# Altium project WR_NIC.PrjPcb (part 1 of 2)
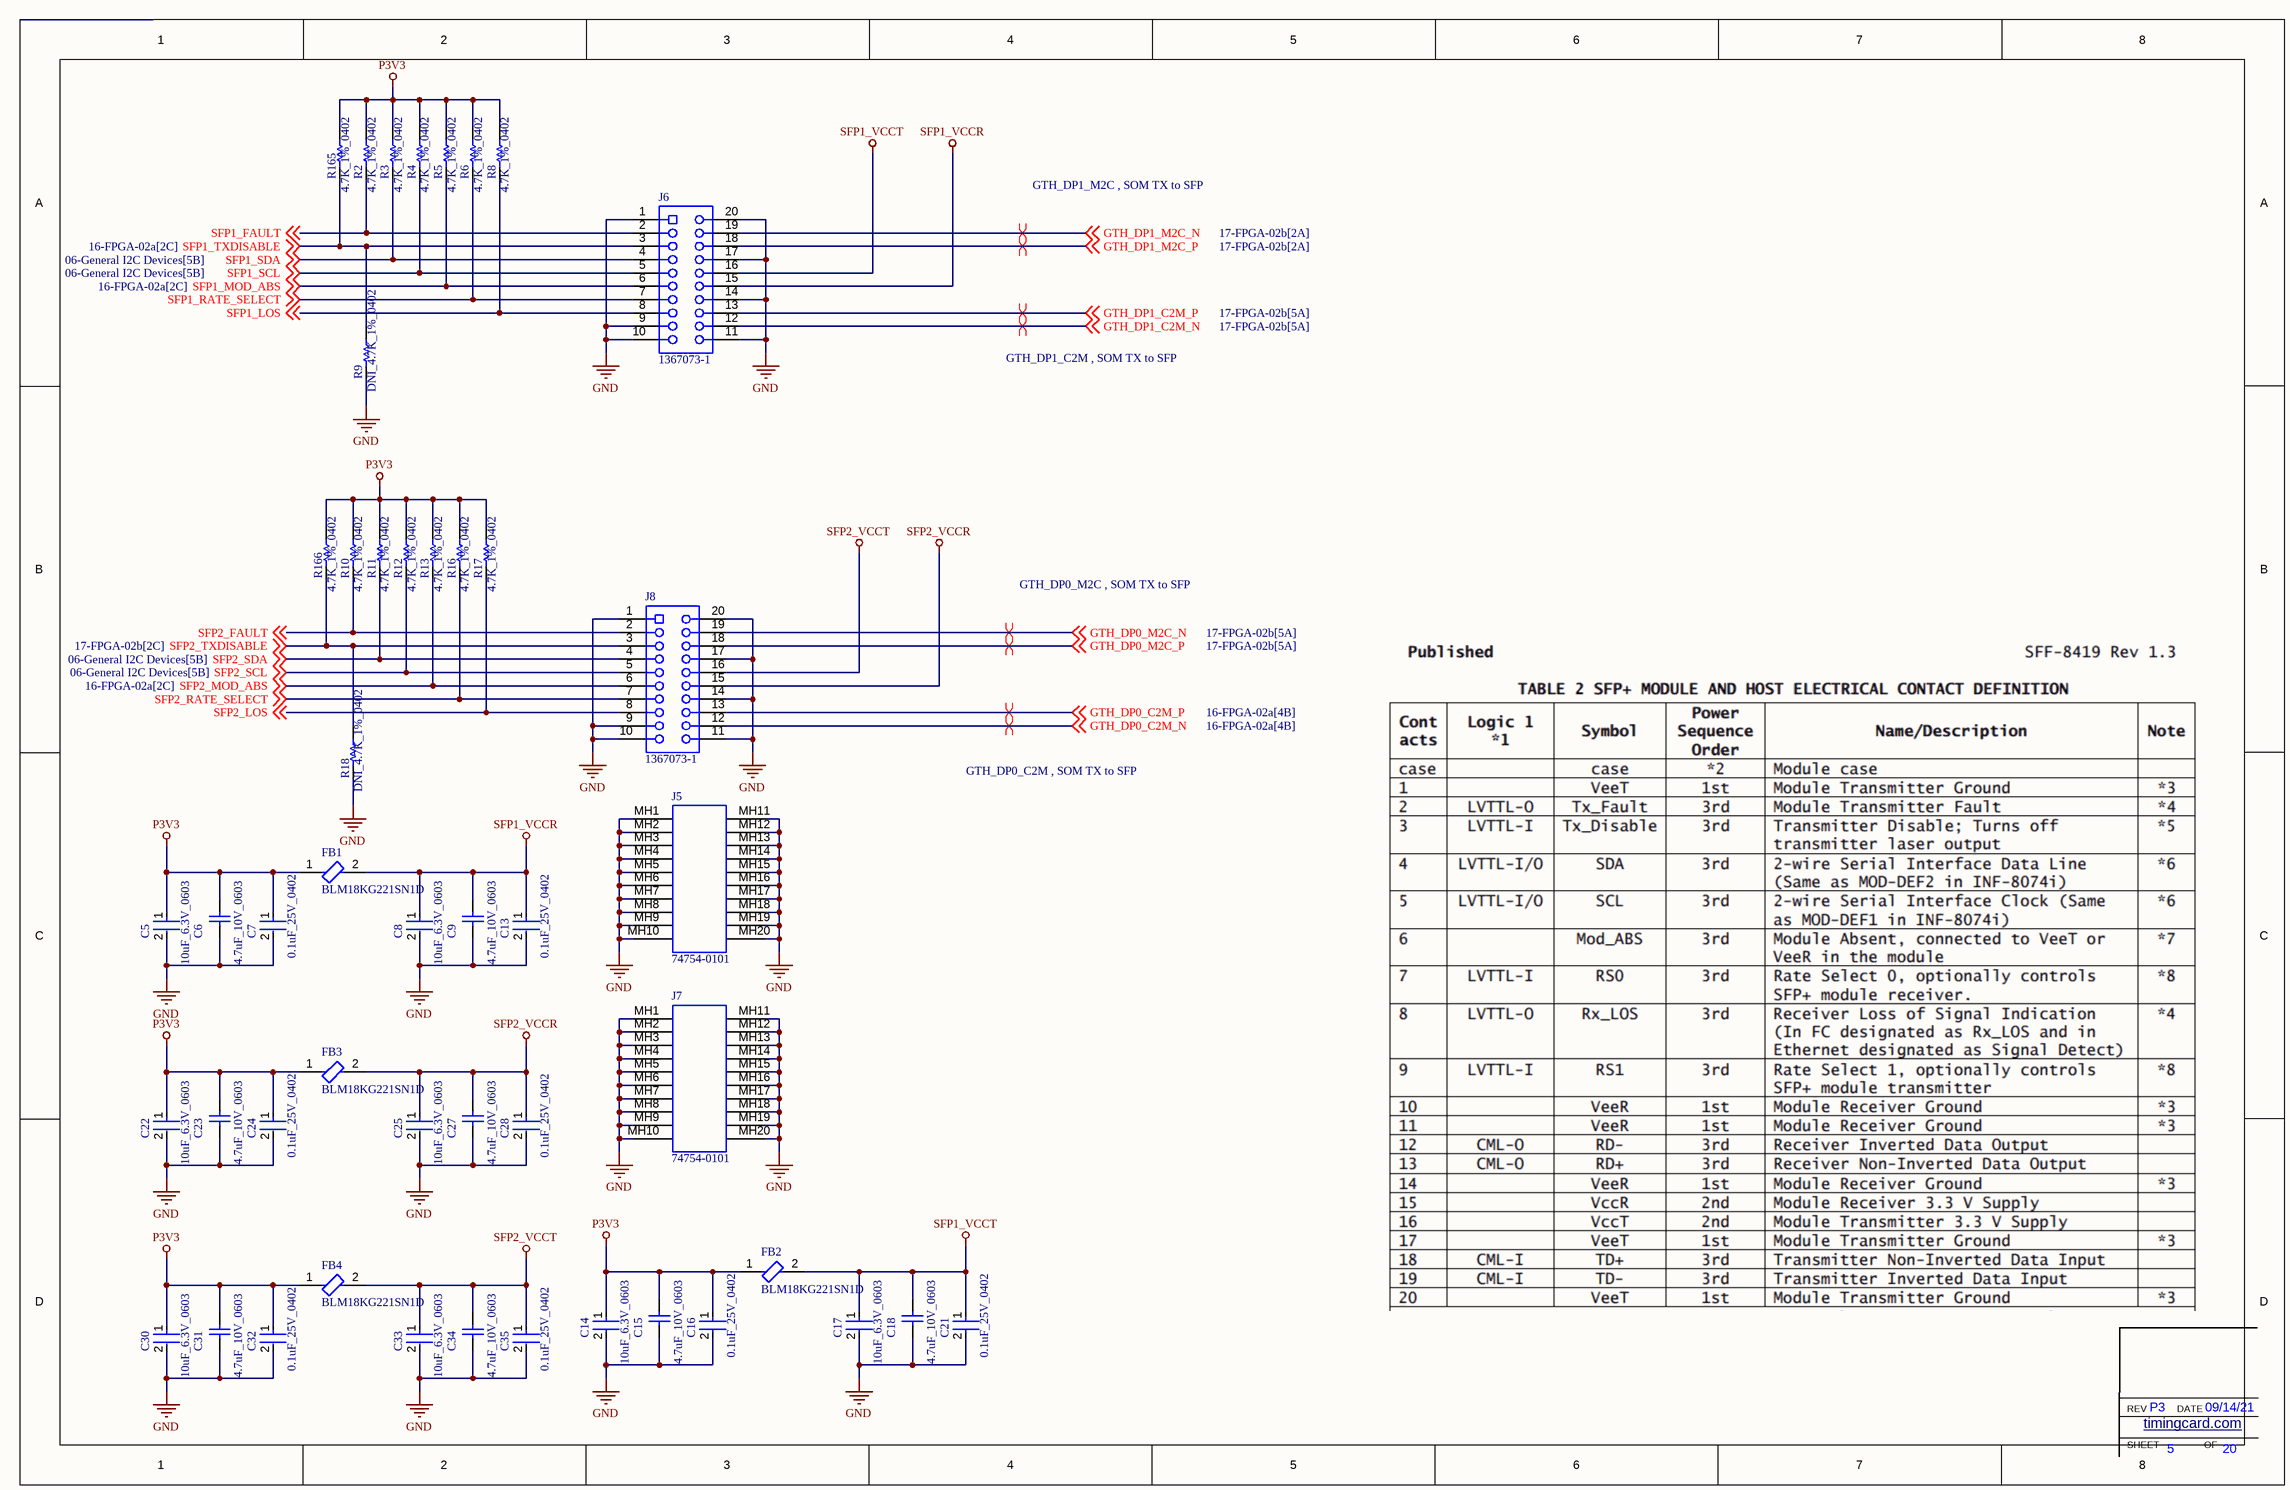
[diagram p0: 05-Front Panel SFP+.SchDoc]
ProjectDate: 09/14/21; ProjectRevision: P3
7 sheets, 308 parts. Net scope: global (net labels, ports and power ports of the same name join across sheets).
Board file: WR_NIC_V1.PcbDoc
Sheets:
  05-Front Panel SFP+.SchDoc
  06-General I2C Devices.SchDoc
  08-DPLL-2.SchDoc
  09-DPLL-3.SchDoc
  13-Experimental.SchDoc
  14-FPGA-01a.SchDoc
  16-FPGA-02a.SchDoc

## Sheet 05-Front Panel SFP+.SchDoc
size Tabloid; Customer: 01910; SheetNumber: 5; SheetTotal: 20

### Parts
C5  10uF_6.3V_0603  [FP-C0603C106M9PACTU-MFG]
C6  4.7uF_10V_0603  [CAPC1608X87X35NL15T15]
C7  0.1uF_25V_0402  [FP-0402-L_1_0_1-W_0_5_0_1-IPC_C]
C8  10uF_6.3V_0603  [FP-C0603C106M9PACTU-MFG]
C9  4.7uF_10V_0603  [CAPC1608X87X35NL15T15]
C13  0.1uF_25V_0402  [FP-0402-L_1_0_1-W_0_5_0_1-IPC_C]
C14  10uF_6.3V_0603  [FP-C0603C106M9PACTU-MFG]
C15  4.7uF_10V_0603  [CAPC1608X87X35NL15T15]
C16  0.1uF_25V_0402  [FP-0402-L_1_0_1-W_0_5_0_1-IPC_C]
C17  10uF_6.3V_0603  [FP-C0603C106M9PACTU-MFG]
C18  4.7uF_10V_0603  [CAPC1608X87X35NL15T15]
C21  0.1uF_25V_0402  [FP-0402-L_1_0_1-W_0_5_0_1-IPC_C]
C22  10uF_6.3V_0603  [FP-C0603C106M9PACTU-MFG]
C23  4.7uF_10V_0603  [CAPC1608X87X35NL15T15]
C24  0.1uF_25V_0402  [FP-0402-L_1_0_1-W_0_5_0_1-IPC_C]
C25  10uF_6.3V_0603  [FP-C0603C106M9PACTU-MFG]
C27  4.7uF_10V_0603  [CAPC1608X87X35NL15T15]
C28  0.1uF_25V_0402  [FP-0402-L_1_0_1-W_0_5_0_1-IPC_C]
C30  10uF_6.3V_0603  [FP-C0603C106M9PACTU-MFG]
C31  4.7uF_10V_0603  [CAPC1608X87X35NL15T15]
C32  0.1uF_25V_0402  [FP-0402-L_1_0_1-W_0_5_0_1-IPC_C]
C33  10uF_6.3V_0603  [FP-C0603C106M9PACTU-MFG]
C34  4.7uF_10V_0603  [CAPC1608X87X35NL15T15]
C35  0.1uF_25V_0402  [FP-0402-L_1_0_1-W_0_5_0_1-IPC_C]
FB1  BLM18KG221SN1D  [FP-BLM18-0_15-t0_8-IPC_B]
FB2  BLM18KG221SN1D  [FP-BLM18-0_15-t0_8-IPC_B]
FB3  BLM18KG221SN1D  [FP-BLM18-0_15-t0_8-IPC_B]
FB4  BLM18KG221SN1D  [FP-BLM18-0_15-t0_8-IPC_B]
J5  74754-0101  [MOLX-74754-0101_V]
J6  1367073-1  [TECO-1367073-1_V]
J7  74754-0101  [MOLX-74754-0101_V]
J8  1367073-1  [TECO-1367073-1_V]
R2  4.7K_1%_0402  [RESC1005X40X25NL10T10]
R3  4.7K_1%_0402  [RESC1005X40X25NL10T10]
R4  4.7K_1%_0402  [RESC1005X40X25NL10T10]
R5  4.7K_1%_0402  [RESC1005X40X25NL10T10]
R6  4.7K_1%_0402  [RESC1005X40X25NL10T10]
R8  4.7K_1%_0402  [RESC1005X40X25NL10T10]
R9  DNI_4.7K_1%_0402  [RESC1005X40X25NL10T10]  (no BOM)
R10  4.7K_1%_0402  [RESC1005X40X25NL10T10]
R11  4.7K_1%_0402  [RESC1005X40X25NL10T10]
R12  4.7K_1%_0402  [RESC1005X40X25NL10T10]
R13  4.7K_1%_0402  [RESC1005X40X25NL10T10]
R16  4.7K_1%_0402  [RESC1005X40X25NL10T10]
R17  4.7K_1%_0402  [RESC1005X40X25NL10T10]
R18  DNI_4.7K_1%_0402  [RESC1005X40X25NL10T10]  (no BOM)
R165  4.7K_1%_0402  [RESC1005X40X25NL10T10]
R166  4.7K_1%_0402  [RESC1005X40X25NL10T10]

### Nets
GND: C5.2 C6.1 C7.2 C8.2 C9.1 C13.2 C14.2 C15.1 C16.2 C17.2 C18.1 C21.2 C22.2 C23.1 C24.2 C25.2 C27.1 C28.2 C30.2 C31.1 C32.2 C33.2 C34.1 C35.2 J5.MH1 J5.MH2 J5.MH3 J5.MH4 J5.MH5 J5.MH6 J5.MH7 J5.MH8 J5.MH9 J5.MH10 J5.MH11 J5.MH12 J5.MH13 J5.MH14 J5.MH15 J5.MH16 J5.MH17 J5.MH18 J5.MH19 J5.MH20 J6.1 J6.9 J6.10 J6.11 J6.14 J6.17 J6.20 J7.MH1 J7.MH2 J7.MH3 J7.MH4 J7.MH5 J7.MH6 J7.MH7 J7.MH8 J7.MH9 J7.MH10 J7.MH11 J7.MH12 J7.MH13 J7.MH14 J7.MH15 J7.MH16 J7.MH17 J7.MH18 J7.MH19 J7.MH20 J8.1 J8.9 J8.10 J8.11 J8.14 J8.17 J8.20 R9.2 R18.2
P3V3: C5.1 C6.2 C7.1 C14.1 C15.2 C16.1 C22.1 C23.2 C24.1 C30.1 C31.2 C32.1 FB1.1 FB2.1 FB3.1 FB4.1 R2.1 R3.1 R4.1 R5.1 R6.1 R8.1 R10.1 R11.1 R12.1 R13.1 R16.1 R17.1 R165.1 R166.1
SFP1_VCCR: C8.1 C9.2 C13.1 FB1.2 J6.15
SFP1_VCCT: C17.1 C18.2 C21.1 FB2.2 J6.16
SFP2_VCCR: C25.1 C27.2 C28.1 FB3.2 J8.15
SFP2_VCCT: C33.1 C34.2 C35.1 FB4.2 J8.16
GTH_DP0_C2M_N: J8.12 ; off-sheet GTH_DP0_C2M_N
GTH_DP0_C2M_P: J8.13 ; off-sheet GTH_DP0_C2M_P
GTH_DP0_M2C_N: J8.19 ; off-sheet GTH_DP0_M2C_N
GTH_DP0_M2C_P: J8.18 ; off-sheet GTH_DP0_M2C_P
GTH_DP1_C2M_N: J6.12 ; off-sheet GTH_DP1_C2M_N
GTH_DP1_C2M_P: J6.13 ; off-sheet GTH_DP1_C2M_P
GTH_DP1_M2C_N: J6.19 ; off-sheet GTH_DP1_M2C_N
GTH_DP1_M2C_P: J6.18 ; off-sheet GTH_DP1_M2C_P
SFP1_FAULT: J6.2 R2.2 ; off-sheet SFP1_FAULT
SFP1_LOS: J6.8 R8.2 ; off-sheet SFP1_LOS
SFP1_MOD_ABS: J6.6 R5.2 ; off-sheet SFP1_MOD_ABS
SFP1_RATE_SELECT: J6.7 R6.2 ; off-sheet SFP1_RATE_SELECT
SFP1_SCL: J6.5 R4.2 ; off-sheet SFP1_SCL
SFP1_SDA: J6.4 R3.2 ; off-sheet SFP1_SDA
SFP1_TXDISABLE: J6.3 R9.1 R165.2 ; off-sheet SFP1_TXDISABLE
SFP2_FAULT: J8.2 R10.2 ; off-sheet SFP2_FAULT
SFP2_LOS: J8.8 R17.2 ; off-sheet SFP2_LOS
SFP2_MOD_ABS: J8.6 R13.2 ; off-sheet SFP2_MOD_ABS
SFP2_RATE_SELECT: J8.7 R16.2 ; off-sheet SFP2_RATE_SELECT
SFP2_SCL: J8.5 R12.2 ; off-sheet SFP2_SCL
SFP2_SDA: J8.4 R11.2 ; off-sheet SFP2_SDA
SFP2_TXDISABLE: J8.3 R18.1 R166.2 ; off-sheet SFP2_TXDISABLE

### Layout directives
differential pair: GTH_DP0_C2M_N, GTH_DP0_C2M_P, GTH_DP0_M2C_N, GTH_DP0_M2C_P, GTH_DP1_C2M_N, GTH_DP1_C2M_P, GTH_DP1_M2C_N, GTH_DP1_M2C_P

### Notes on the sheet
- GTH_DP1_M2C , SOM TX to SFP
- GTH_DP1_C2M , SOM TX to SFP
- GTH_DP0_M2C , SOM TX to SFP
- GTH_DP0_C2M , SOM TX to SFP
- SHEET
- REV
- timingcard.com <http://timingcard.com>
- DATE
- OF

### Library data of the parts
C5 C8 C14 C17 C22 C25 C30 C33 = CMP-2006-02285-3: CAP CER 10UF 6.3V X5R 0603; Manufacturer Part Number: C0603C106M9PACTU; Manufacturer: Kemet; Material: Ceramic; Temperature Coefficient: 15%; Tolerance: 20%; Category: Cap; Height: 0.9mm; Digikey Description: CAP CER 10UF 6.3V X5R 0603; Mouser Description: In a Pack of 10, KEMET 0603 (1608M) 10µF MLCC 6.3V dc ±20% SMD C0603C106M9PACTU; Voltage Rating: 6.3V; Device Class L2: Capacitors; Temperature Range Low: -55°C; Temperature Characteristic: X5R; ComponentLink2Description: Datasheet; Ipc Land Pattern Name: CAPC16080X80; ComponentLink2URL: http://www.kemet.com/Lists/ProductCatalog/Attachments/19/KEM_C1006_X5R_SMD.pdf; Capacitance: 10uF; Temperature Range High: +85°C; Device Class L3: Ceramic Capacitors; RoHS: TRUE; Automotive: No; Value: 10uF; Temperature: -55°C to +85°C; Device Class L1: Passive Components; Package: C0603C106M9PACTU; Lead Free: Yes; Octopart: https://octopart.com/c0603c106m9pactu-kemet-8375727
C6 C9 C15 C18 C23 C27 C31 C34 = CMP-2006-03238-1: Part Number: C0603C475K8PACTU; Manufacturer: Kemet
C7 C13 C16 C21 C24 C28 C32 C35 = CMP-2008-02519-2: General Purpose Ceramic Capacitor, 0402, 100nF, 10%, X7R, 15%, 25V; Package Quantity: 1; Capacitance: 100nF; Min Operating Temperature: -55°C; Voltage: 25V; Voltage Rating: 25V; Construction: Flat; Max Operating Temperature: 125°C; Radiation Hardening: No; Depth: 0.5mm; Thickness: 0.022inch; Voltage Rating (DC): 25V; Number of Pins: 2; Lead Free: Lead Free; Series: -; REACH SVHC: No SVHC; Length: 1mm; Dielectric: X7R; RoHS Compliant: Yes; Mount: Surface Mount; Packaging: Tape and Reel; Case/Package: 0402; Case Code (Imperial): 0402; Termination: SMD/SMT; Width: 0.02inch; Case Code (Metric): 1005; Tolerance: 10%
FB1-FB4 = CMP-0686-00556-7: Chip Ferrite Bead, 0603, 220Ω @ 100MHz, 0.05Ω, 25%, 2.2A; DC Resistance (DCR): 50mR; Number of Circuits: 1; Impedance: 220R; Current Rating: 2.2A; Material: Ferrite; Test Frequency: 100MHz; Depth: 0.8mm; Series: BLM18K; RoHS Compliant: Yes; Termination: SMD/SMT; Max Current Rating: 2.2A; Case Code (Metric): 1608; Radiation Hardening: No; Number of Pins: 2; Length: 1.6mm; Lead Free: Lead Free; Package Quantity: 1; Height: 0.8mm; Core Material: Ferrite; Inductor Type: FERRITE BEAD; Min Operating Temperature: -55°C; Case/Package: 0603; Case Code (Imperial): 0603; Number of Lines: 1; Packaging: Tape and Reel; REACH SVHC: No SVHC; Max Operating Temperature: 125°C; Military Standard: Not; DC Resistance-Max: 50mR; Width: 0.8mm; DC Current: 2.2A; Max DC Current: 2.2A; Tolerance: 25%; Weight: 7.1E-05oz
J5 J7 = CMP-1704-00003-3: SFP+ Cage, Single Port, Height 10.85 mm, Tail Height 3.05 mm, -40 to 85 degC, RoHS, Tray; RoHSCompliant: True; ComponentLink3URL: http://www.molex.com/pdm_docs/sd/747540101_sd.pdf; Width: 49 mm; Height: 10.85 mm; Mounting Technology: Through Hole; ComponentLink2Description: Datasheet; ComponentLink3Description: Package Specification; DatasheetVersion: Rev. Jul-15; Package Quantity: 1152; PackageDescription: SFP+ Cage, Single Port, Height 10.85 mm, Tail Height 3.05 mm; Radiation Hardening: No; PackageVersion: Rev. J, 02/2015; ComponentLink1Description: Manufacturer URL; PartNumber: 74754-0101; ComponentLink1URL: http://www.molex.com/; Packaging: Tray; Length: 15.9 mm; ComponentLink2URL: http://www.molex.com/webdocs/datasheets/pdf/en-us/0747540101_IO_CONNECTORS.pdf
J6 J8 = CMP-2000-05488-1: Female Connector, Pitch 0.8 mm, 2 x 10 Position, Height 5.4 mm, -55 to 85 degC, RoHS, Tape and Reel; Manufacturer: TE Connectivity; Product Training Modules: HighSpeedPluggableI/OSolutions; 3D Model: 1367073-1.pdf; Connector Type: SFP; Other Names: A97430DKR; Mating Products: 516-2084-ND / -TXRXOPTICALSFF1.25GBDISCSI; Dynamic Catalog: SFPConnectors; Featured Product: HighSpeedPluggableI-OSolutions; Connector Style: Receptacle; Associated Product: A103997CT-ND / -CONNSFPCAGESINGLEW/OPIPE / A103997TR-ND / -CONNSFPCAGESINGLEW/OPIPE / 1367645-3-ND / -CONNCAGE&HEATSINKSGLPORTTIN / 1367645-2-ND / -CONNCAGE&HEATSINKSGLPORTTIN / 1888424-1-ND / -CONNCAGE1X2SFPENHANCEDEMI / 1367643-1-ND / -CONNCAGESNGLPORTDBLSIDETIN / 1489962-1-ND / -CONNSFPCAGESINGLEW/OPIPE / 1367645-1-ND / -CONNCAGE&HEATSINKSGLPORTTIN / A99375-ND / -CONNSFPCAGE1X4PIN-IN-PASTE / A97412CT-ND / -CONNSFPLOWERCAGEPCB / More...; Number of Positions: 20; Package Reference: 1367073-1; Package Description: Female Connector, Pitch 0.8 mm, 2 x 10 Position, Height 5.4 mm; RoHS Information: 1367073-1StatementofCompliance; Contact Finish: Gold; Datasheet URL: http://www.te.com/commerce/DocumentDelivery/DDEController?Action=showdoc&DocId=Customer+Drawing%7F1367073%7FK%7Fpdf%7FEnglish%7FENG_CD_1367073_K.pdf%7F1367073-1; Datasheet Version: Rev. K, 12/2012; Contact Finish Thickness: 15µin(0.38µm); Category: Connectors,Interconnects; Mounting Type: SurfaceMount,RightAngle; Mounting Technology: SurfaceMount; Packaging: Digi-Reel®; Manufacturer URL: http://www.te.com/; Family: PluggableConnectors; Standard Package: 1; Termination: Solder
R2-R6 R8-R13 R16-R18 R165 R166 = CMP-2002-05217-1: Manufacturer: Bourns; Part Number: CR0402-FX-4701GLF

## Sheet 06-General I2C Devices.SchDoc
size B; SheetNumber: 6; SheetTotal: 20
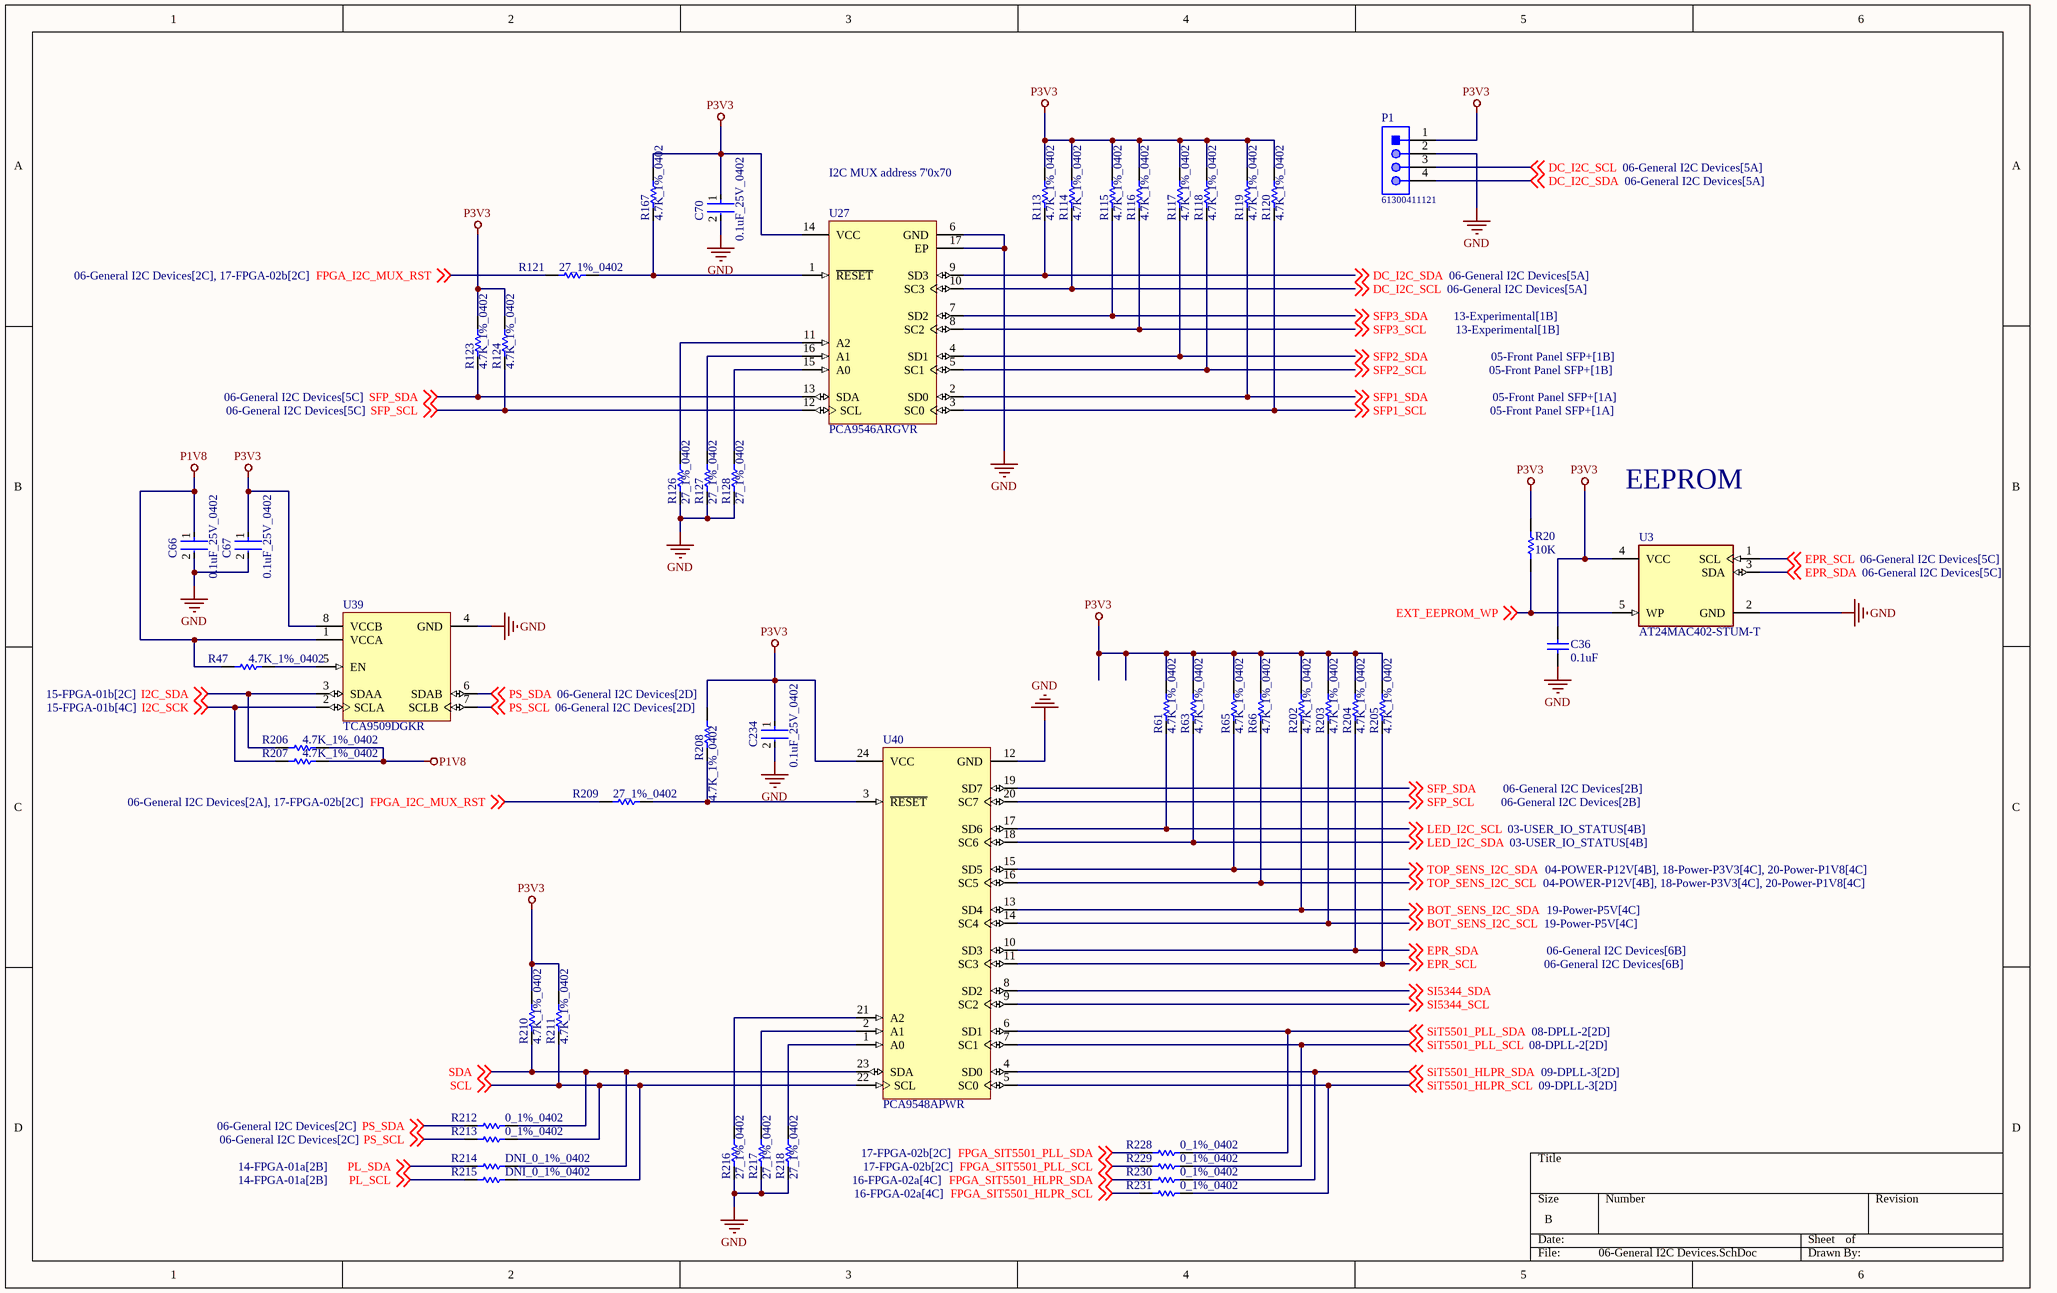
[diagram p1: 06-General I2C Devices.SchDoc]

### Parts
C36  0.1uF  [CAPC1608X87X45ML20T05]
C66  0.1uF_25V_0402  [FP-0402-L_1_0_1-W_0_5_0_1-IPC_C]
C67  0.1uF_25V_0402  [FP-0402-L_1_0_1-W_0_5_0_1-IPC_C]
C70  0.1uF_25V_0402  [FP-0402-L_1_0_1-W_0_5_0_1-IPC_C]
C234  0.1uF_25V_0402  [FP-0402-L_1_0_1-W_0_5_0_1-IPC_C]
P1  61300411121  [61300411121]
R20  10K  [RESC1608X55X30LL15T20]
R47  4.7K_1%_0402  [RESC1005X40X25NL10T10]
R61  4.7K_1%_0402  [RESC1005X40X25NL10T10]
R63  4.7K_1%_0402  [RESC1005X40X25NL10T10]
R65  4.7K_1%_0402  [RESC1005X40X25NL10T10]
R66  4.7K_1%_0402  [RESC1005X40X25NL10T10]
R113  4.7K_1%_0402  [RESC1005X40X25NL10T10]
R114  4.7K_1%_0402  [RESC1005X40X25NL10T10]
R115  4.7K_1%_0402  [RESC1005X40X25NL10T10]
R116  4.7K_1%_0402  [RESC1005X40X25NL10T10]
R117  4.7K_1%_0402  [RESC1005X40X25NL10T10]
R118  4.7K_1%_0402  [RESC1005X40X25NL10T10]
R119  4.7K_1%_0402  [RESC1005X40X25NL10T10]
R120  4.7K_1%_0402  [RESC1005X40X25NL10T10]
R121  27_1%_0402  [RESC1005X40X25NL05T05]
R123  4.7K_1%_0402  [RESC1005X40X25NL10T10]
R124  4.7K_1%_0402  [RESC1005X40X25NL10T10]
R126  27_1%_0402  [RESC1005X40X25NL05T05]
R127  27_1%_0402  [RESC1005X40X25NL05T05]
R128  27_1%_0402  [RESC1005X40X25NL05T05]
R167  4.7K_1%_0402  [RESC1005X40X25NL10T10]
R202  4.7K_1%_0402  [RESC1005X40X25NL10T10]
R203  4.7K_1%_0402  [RESC1005X40X25NL10T10]
R204  4.7K_1%_0402  [RESC1005X40X25NL10T10]
R205  4.7K_1%_0402  [RESC1005X40X25NL10T10]
R206  4.7K_1%_0402  [RESC1005X40X25NL10T10]
R207  4.7K_1%_0402  [RESC1005X40X25NL10T10]
R208  4.7K_1%_0402  [RESC1005X40X25NL10T10]
R209  27_1%_0402  [RESC1005X40X25NL05T05]
R210  4.7K_1%_0402  [RESC1005X40X25NL10T10]
R211  4.7K_1%_0402  [RESC1005X40X25NL10T10]
R212  0_1%_0402  [RESC1005X40X25LL05T05]
R213  0_1%_0402  [RESC1005X40X25LL05T05]
R214  DNI_0_1%_0402  [RESC1005X40X25LL05T05]  (no BOM)
R215  DNI_0_1%_0402  [RESC1005X40X25LL05T05]  (no BOM)
R216  27_1%_0402  [RESC1005X40X25NL05T05]
R217  27_1%_0402  [RESC1005X40X25NL05T05]
R218  27_1%_0402  [RESC1005X40X25NL05T05]
R228  0_1%_0402  [RESC1005X40X25LL05T05]
R229  0_1%_0402  [RESC1005X40X25LL05T05]
R230  0_1%_0402  [RESC1005X40X25LL05T05]
R231  0_1%_0402  [RESC1005X40X25LL05T05]
U3  AT24MAC402-STUM-T  [FP-5TS1-IPC_C]
U27  PCA9546ARGVR  [RGV0016A_V]
U39  TCA9509DGKR  [DGK0008A_L]
U40  PCA9548APWR  [PW0024A_N]

### Nets
GND: C36.1 C66.2 C67.2 C70.2 C234.2 P1.2 R126.1 R127.1 R128.1 R216.1 R217.1 R218.1 U3.2(GND) U27.6(GND) U27.17(EP) U39.4(GND) U40.12(GND)
P1V8: C66.1 R47.2 R206.1 R207.1 U39.1(VCCA)
P3V3: C36.2 C67.1 C70.1 C234.1 P1.1 R20.2 R61.2 R63.2 R65.2 R66.2 R113.2 R114.2 R115.2 R116.2 R117.2 R118.2 R119.2 R120.2 R123.2 R124.2 R167.2 R202.2 R203.2 R204.2 R205.2 R208.2 R210.2 R211.2 U3.4(VCC) U27.14(VCC) U39.8(VCCB) U40.24(VCC)
BOT_SENS_I2C_SCL: R203.1 U40.14(SC4) ; off-sheet BOT_SENS_I2C_SCL
BOT_SENS_I2C_SDA: R202.1 U40.13(SD4) ; off-sheet BOT_SENS_I2C_SDA
DC_I2C_SCL: P1.3 R114.1 U27.10(SC3) ; off-sheet DC_I2C_SCL
DC_I2C_SDA: P1.4 R113.1 U27.9(SD3) ; off-sheet DC_I2C_SDA
EPR_SCL: R205.1 U3.1(SCL) U40.11(SC3) ; off-sheet EPR_SCL
EPR_SDA: R204.1 U3.3(SDA) U40.10(SD3) ; off-sheet EPR_SDA
EXT_EEPROM_WP: R20.1 U3.5(WP) ; off-sheet EXT_EEPROM_WP
FPGA_I2C_MUX_RST: R121.1 R209.1 ; off-sheet FPGA_I2C_MUX_RST
FPGA_SIT5501_HLPR_SCL: R231.1 ; off-sheet FPGA_SIT5501_HLPR_SCL
FPGA_SIT5501_HLPR_SDA: R230.1 ; off-sheet FPGA_SIT5501_HLPR_SDA
FPGA_SIT5501_PLL_SCL: R229.1 ; off-sheet FPGA_SIT5501_PLL_SCL
FPGA_SIT5501_PLL_SDA: R228.1 ; off-sheet FPGA_SIT5501_PLL_SDA
I2C_SCK: R207.2 U39.2(SCLA) ; off-sheet I2C_SCK
I2C_SDA: R206.2 U39.3(SDAA) ; off-sheet I2C_SDA
LED_I2C_SCL: R61.1 U40.17(SD6) ; off-sheet LED_I2C_SCL
LED_I2C_SDA: R63.1 U40.18(SC6) ; off-sheet LED_I2C_SDA
PL_SCL: R215.1 ; off-sheet PL_SCL
PL_SDA: R214.1 ; off-sheet PL_SDA
PS_SCL: R213.1 U39.7(SCLB) ; off-sheet PS_SCL
PS_SDA: R212.1 U39.6(SDAB) ; off-sheet PS_SDA
SCL: R211.1 R213.2 R215.2 U40.22(SCL) ; off-sheet SCL
SDA: R210.1 R212.2 R214.2 U40.23(SDA) ; off-sheet SDA
SFP1_SCL: R120.1 U27.3(SC0) ; off-sheet SFP1_SCL
SFP1_SDA: R119.1 U27.2(SD0) ; off-sheet SFP1_SDA
SFP2_SCL: R118.1 U27.5(SC1) ; off-sheet SFP2_SCL
SFP2_SDA: R117.1 U27.4(SD1) ; off-sheet SFP2_SDA
SFP3_SCL: R116.1 U27.8(SC2) ; off-sheet SFP3_SCL
SFP3_SDA: R115.1 U27.7(SD2) ; off-sheet SFP3_SDA
SFP_SCL: R124.1 U27.12(SCL) U40.20(SC7) ; off-sheet SFP_SCL
SFP_SDA: R123.1 U27.13(SDA) U40.19(SD7) ; off-sheet SFP_SDA
SI5344_SCL: U40.9(SC2) ; off-sheet SI5344_SCL
SI5344_SDA: U40.8(SD2) ; off-sheet SI5344_SDA
SiT5501_HLPR_SCL: R231.2 U40.5(SC0) ; off-sheet SiT5501_HLPR_SCL
SiT5501_HLPR_SDA: R230.2 U40.4(SD0) ; off-sheet SiT5501_HLPR_SDA
SiT5501_PLL_SCL: R229.2 U40.7(SC1) ; off-sheet SiT5501_PLL_SCL
SiT5501_PLL_SDA: R228.2 U40.6(SD1) ; off-sheet SiT5501_PLL_SDA
TOP_SENS_I2C_SCL: R66.1 U40.16(SC5) ; off-sheet TOP_SENS_I2C_SCL
TOP_SENS_I2C_SDA: R65.1 U40.15(SD5) ; off-sheet TOP_SENS_I2C_SDA
NetR47_1: R47.1 U39.5(EN)
NetR121_2: R121.2 R167.1 U27.1(~{RESET})
NetR126_2: R126.2 U27.11(A2)
NetR127_2: R127.2 U27.16(A1)
NetR128_2: R128.2 U27.15(A0)
NetR208_1: R208.1 R209.2 U40.3(~{RESET})
NetR216_2: R216.2 U40.21(A2)
NetR217_2: R217.2 U40.2(A1)
NetR218_2: R218.2 U40.1(A0)

### Notes on the sheet
- I2C MUX address 7'0x70
- EEPROM

### Library data of the parts
C36 = CMP-2006-00003-1: C0603X104K5RACAUTO; Manufacturer: Kemet; Part Number: C0603X104K5RACAUTO
C66 C67 C70 C234 = CMP-2008-02519-2: as C7 on sheet 05-Front Panel SFP+; Package Quantity: 1; Capacitance: 100nF; Min Operating Temperature: -55°C; Voltage: 25V; Voltage Rating: 25V; Construction: Flat; Max Operating Temperature: 125°C; Radiation Hardening: No; Depth: 0.5mm; Thickness: 0.022inch; Voltage Rating (DC): 25V; Number of Pins: 2; Lead Free: Lead Free; Series: -; REACH SVHC: No SVHC; Length: 1mm; Dielectric: X7R; RoHS Compliant: Yes; Mount: Surface Mount; Packaging: Tape and Reel; Case/Package: 0402; Case Code (Imperial): 0402; Termination: SMD/SMT; Width: 0.02inch; Case Code (Metric): 1005; Tolerance: 10%
P1 = CMP-1502-01064-1: THT Vertical Pin Header WR-PHD, Pitch 2.54 mm, Single Row, 4 pins; Manufacturer: Wurth Elektronik; Withstanding Voltage: 500VAC; Rated Current: 3A; Working Voltage: 250VAC; Pin Number: 4; Gender: Male; Contact Resistance: 20mOhm; Pitch: 2.54mm; Manufacturer URL: http://www.we-online.de; Operating Temperature: -40to105degC; Packaging: Bag; Mounting Technology: THT; Package Reference: 61300411121; Datasheet URL: https://katalog.we-online.de/em/datasheet/6130xx11121.pdf; Publisher: WurthElektronik; Part Number: 61300411121; Row Number: Single; Orientation: Vertical
R20 = CMP-2000-06990-1: Chip Resistor, 10 KOhm, +/- 1%, 0.1 W, -55 to 155 degC, 0603 (1608 Metric), RoHS, Tape and Reel RMCF0603FT10K0; Manufacturer: Stackpole-Electronics-Inc.; Temperature Coefficient: ±100ppm/°C; Power (Watts): 0.1W,1/10W; Package / Case: 0603(1608Metric); Datasheet Version: 01/2017; Resistance (Ohms): 10k; Features: AutomotiveAEC-Q200; Packaging: CutTape(CT); Series: RMCF; Height: 0.022"(0.55mm); Tolerance: ±1%; Manufacturer URL: https://www.seielect.com/; Datasheet URL: https://www.seielect.com/Catalog/SEI-RMCF_RMCP.pdf; Supplier Device Package: 0603; Number of Terminations: 2; Family: ChipResistor-SurfaceMount; Package Reference: 0603; Size / Dimension: 0.061"Lx0.031"W(1.55mmx0.80mm); Mounting Technology: SurfaceMount; Package Description: 2-Pin Surface Mount Device, Body 1.55 x 0.8 mm; Operating Temperature: -55°C~155°C; Composition: ThickFilm; Category: Resistors
R47 R61 R63 R65 R66 R113-R120 R123 R124 R167 R202-R208 R210 R211 = CMP-2002-05217-1: as R2 on sheet 05-Front Panel SFP+
R121 R126-R128 R209 R216-R218 = CMP-2002-08434-1: Part Number: CRCW040227R0FKED; Manufacturer: Vishay Dale
R212-R215 R228-R231 = CMP-2000-07451-1: Chip Resistor, 0 Ohm, 0.1 W, -55 to 155 degC, 0402 (1005 Metric), RoHS, Tape and Reel; Manufacturer: Panasonic; Voltage Rating (DC): 50V; Temperature Coefficient: 600ppm/��C; Max Power Dissipation: 100mW; Resistance: 0mOhm; Tolerance: 5%; Number of Terminations: 2; Mount: SurfaceMount; Height: 0.35mm; Packaging: TapeandReel; Contact Plating: Tin; Manufacturer URL: http://www.panasonic.com/; Composition: ThickFilm; Max Operating Temperature: 155degC; REACH SVHC: NoSVHC; Case/Package: 0402; Package Reference: 402; Depth: 0.5mm; Package Description: 2-Pin Surface Mount Device, Body 1 x 0.5 mm; Datasheet URL: https://industrial.panasonic.com/cdbs/www-data/pdf/RDA0000/AOA0000C301.pdf; RoHSCompliant: True; Case Code (Imperial): 0402; Military Standard: Not; Min Operating Temperature: -55degC; Power Rating: 100mW; Datasheet Version: 03/2015; Length: 1mm; Case Code (Metric): 1005; Termination: SMD/SMT; Mounting Technology: SurfaceMount; Voltage Rating: 50V; Width: 0.02inch; Package Quantity: 1; Lead Free: LeadFree; Radiation Hardening: No
U3 = CMP-06313-000011-1: IC EEPROM 2K I2C 1MHZ SOT23-5; Manufacturer: Microchip; Memory Size: 2Kbits; Min Supply Voltage: 1.7V; Max Supply Voltage: 5.5V; Frequency: 1000kHz; Standoff Height: 0mm; Nominal Supply Current: 0.4-2mA; Access Time: 0.55us; Interface: I2C,2-Wire; Temperature Range Low: -40°C; Height: 1mm; ComponentLink2URL: http://ww1.microchip.com/downloads/en/DeviceDoc/Atmel-8807-SEEPROM-AT24MAC402-602-Datasheet.pdf; Ipc Land Pattern Name: SOT95P280X100-5; Category: IC; Memory Type: EEPROM; Digikey Description: IC EEPROM 2K I2C 1MHZ SOT23-5; Manufacturer Part Number: AT24MAC402-STUM-T; Device Class L1: Integrated Circuits (ICs); Temperature Range High: +85°C; ComponentLink2Description: Datasheet; RoHS: TRUE; Mouser Description: EEPROM Serial-I2C 2K-bit 256 x 8 1.8V/2.5V/3.3V/5V 5-Pin SOT-23 T/R; Octopart: https://octopart.com/at24mac402-stum-t-microchip-77758112; Temperature: -40°C to +85°C; Package: 5TS1; Device Class L3: EEPROM; Automotive: No; Device Class L2: Memory; Lead Free: Yes
U27 = CMP-0314-00065-2: 4-Channel I2C and SMBus Multiplexer with Reset Functions, 2.3 to 5.5 V, -40 to 85 degC, 16-pin VQFN (RGV), Green (RoHS & no Sb/Br); Manufacturer: Texas Instruments; fSCLK(Max)(MHz): 100, 400; I2C Address: 1110 xxx; VCC(Min)(V): 2.3; 5V Tolerant I/O: Yes; Channel Width: 4; VCC(Max)(V): 5.5; tpd max(ns): 0.3, 1; Simultaneously Active Channels: 1 to 4; Max Frequency(kHz): 400; SubFamily: I2C Multiplexer, Switch; Mounting Technology: Surface Mount; ComponentLink2Description: Package Specification; DatasheetVersion: SCPS148E; PackageDescription: 16-Pin Plastic Quad Flat No-Lead, 4 x 4 mm Body, 0.65 mm Pitch, 2.16 x 2.16 mm Exposed Pad; PackageVersion: revF, Jun-2011; ComponentLink1URL: http://www.ti.com/general/docs/lit/getliterature.tsp?genericPartNumber=PCA9546A&fileType=pdf; Eco-Plan: Green (RoHS & no Sb/Br); Reset Input: Yes; Vcc range(V): 2.3 to 5.5; ComponentLink2URL: http://www.ti.com/litv/pdf/mpds178g; Open Drain I/O Type: Yes; PackageReference: RGV0016A; PartNumber: PCA9546ARGVR; ComponentLink1Description: Datasheet
U39 = CMP-0314-00313-2: Level Translating I2C Bus Repeater, 2.7 to 5.5 V, -40 to 85 degC, 8-pin MSOP (DGK), Green (RoHS & no Sb/Br); Manufacturer: Texas Instruments; Slave Side I2C Bus Capacitance Supported(pF): 400; Open Drain I/O Type: Yes; SubFamily: I2C Hub, Buffer, Repeater; VCC(Max)(V): 5.5; VCC(Min)(V): 2.7; fSCLK(Max)(MHz): 0.4; ComponentLink2URL: http://www.ti.com/litv/pdf/msoi002j; PartNumber: TCA9509DGKR; ComponentLink1URL: http://www.ti.com/general/docs/lit/getliterature.tsp?genericPartNumber=TCA9509&fileType=pdf; Code_JEDEC: MO-187-AA; ComponentLink2Description: Package Specification; DatasheetVersion: SCPS225B; PackageVersion: revE, May-2006; Eco-Plan: Green (RoHS & no Sb/Br); Max Frequency(kHz): 400; ComponentLink1Description: Datasheet; Vcc range(V): 2.7 to 5.5; Mounting Technology: Surface Mount; PackageDescription: 8-Pin Thin Small Outline Package 3 x 3 mm Body ,0.65 mm Pitch; PackageReference: DGK0008A; Enable Pin: Yes; Master Side I2C Bus Capacitance Supported(pF): 400
U40 = CMP-0314-00341-2: 8-Channel I2C Switch with Reset, 2.3 to 5.5 V, -40 to 85 degC, 24-pin TSSOP (PW), Green (RoHS & no Sb/Br); Manufacturer: Texas Instruments; Reset Input: Yes; I2C Address: 1110 xxx; VCC(Max)(V): 5.5; Channel Width: 8; fSCLK(Max)(MHz): 100, 400; SubFamily: I2C Multiplexer, Switch; VCC(Min)(V): 2.3; Simultaneously Active Channels: 1 to 8; Max Frequency(kHz): 400; Technology Family: PCA; ComponentLink2Description: Package Specification; DatasheetVersion: SCPS143C; Code_JEDEC: MO-153; Eco-Plan: Green (RoHS & no Sb/Br); PartNumber: PCA9548APWR; PackageReference: PW0024A; PackageDescription: 24-Pin Thin Small Outline Package 0.65 mm Pitch; Vcc range(V): 2.3 to 5.5; ComponentLink1Description: Datasheet; ComponentLink1URL: http://www.ti.com/general/docs/lit/getliterature.tsp?genericPartNumber=PCA9548A&fileType=pdf; Open Drain I/O Type: Yes; 5V Tolerant I/O: Yes; PackageVersion: revG, Feb-2011; Mounting Technology: Surface Mount; ComponentLink2URL: http://www.ti.com/litv/pdf/mpds177g

## Sheet 08-DPLL-2.SchDoc
size B; SheetNumber: 8; SheetTotal: 20
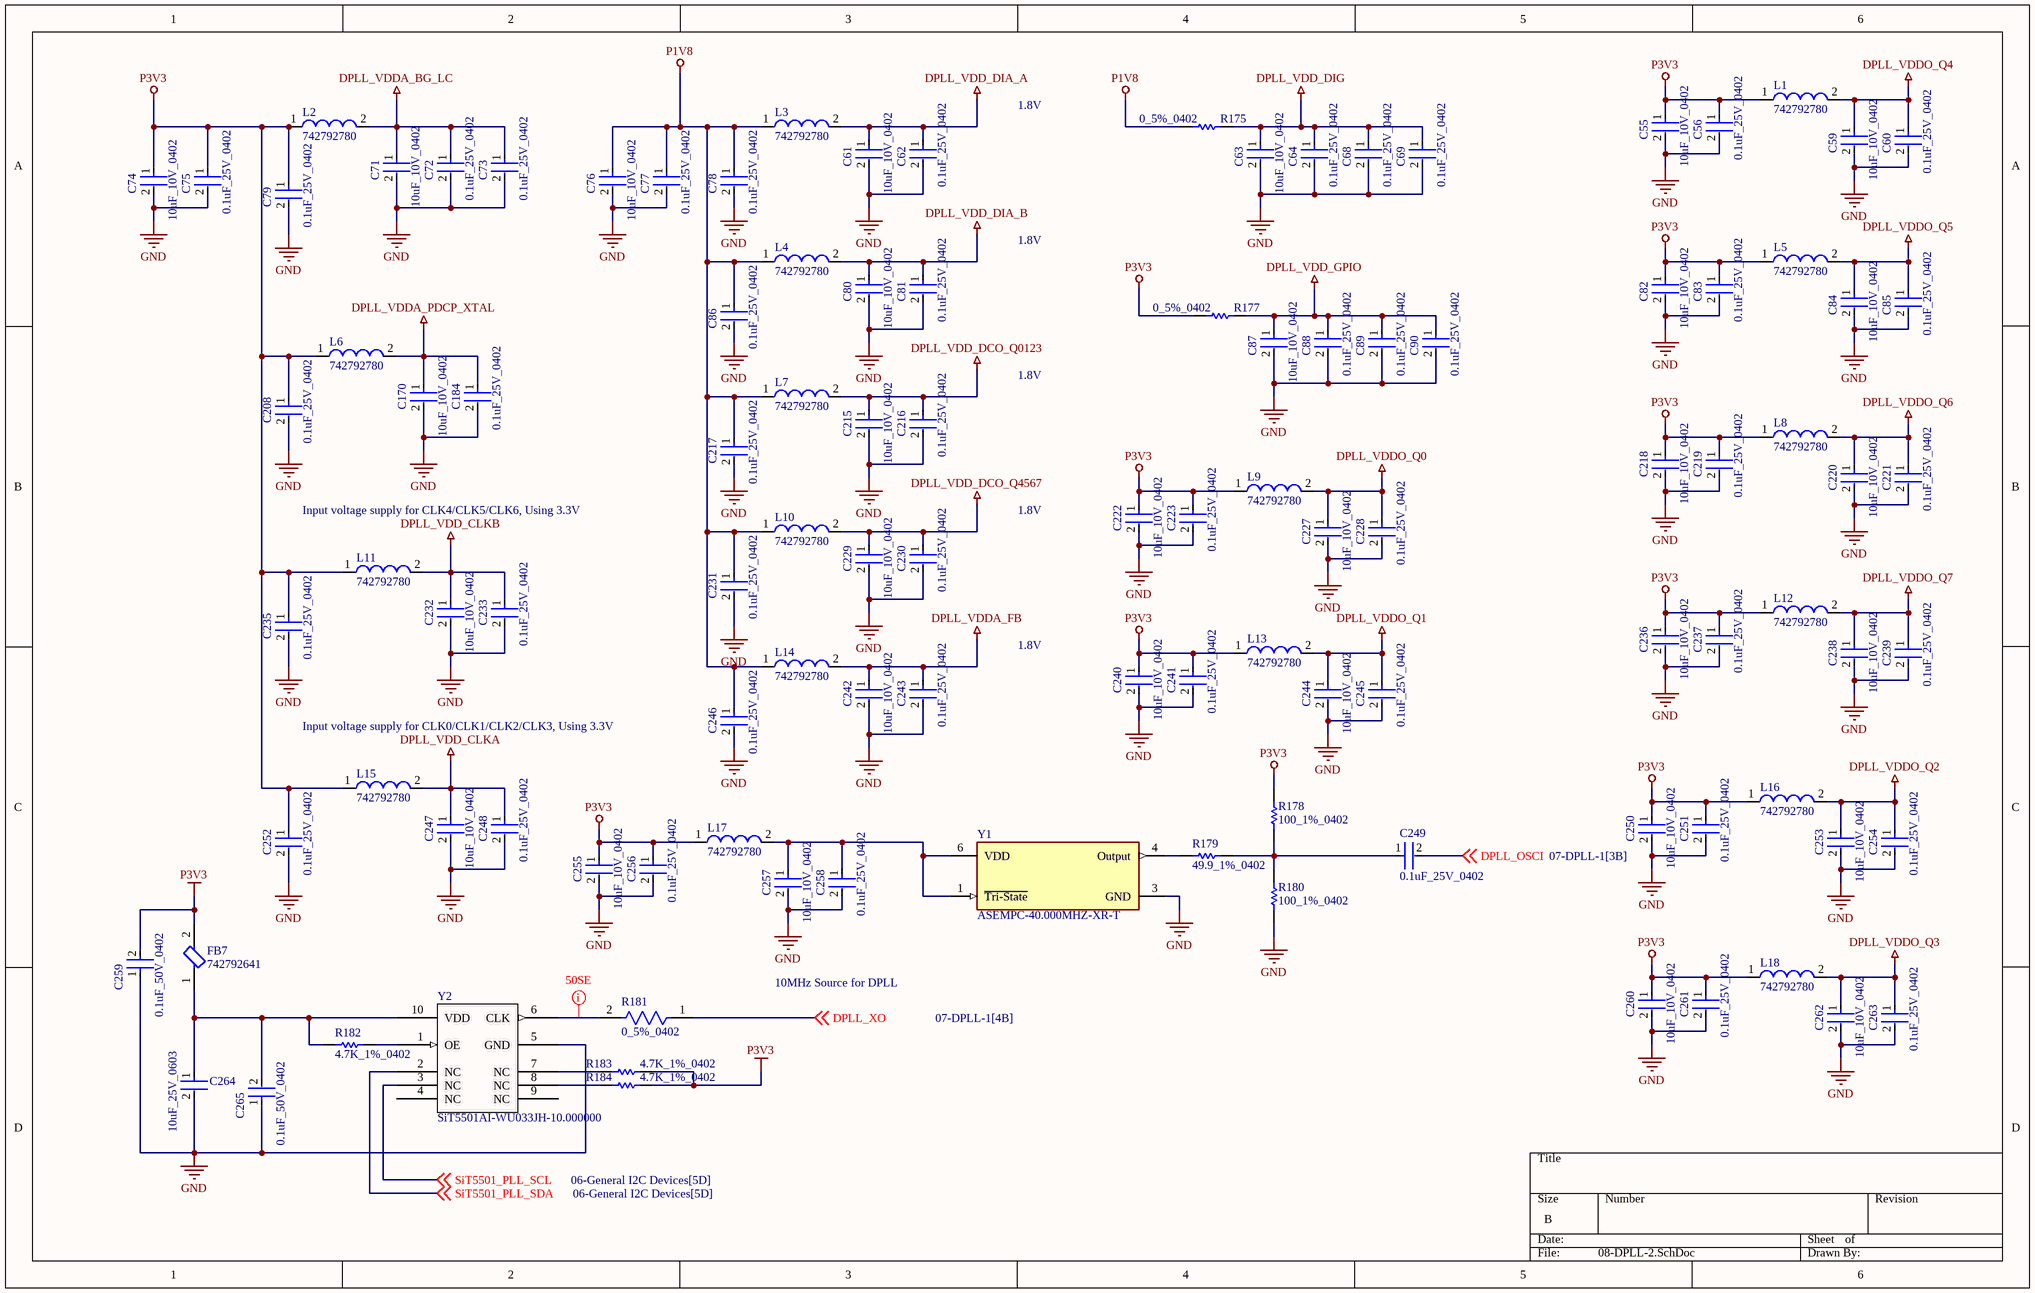
[diagram p2: 08-DPLL-2.SchDoc]

### Parts
C55  10uF_10V_0402  [FP-CL05A106MP5NUNC-MFG]
C56  0.1uF_25V_0402  [FP-0402-L_1_0_1-W_0_5_0_1-IPC_C]
C59  10uF_10V_0402  [FP-CL05A106MP5NUNC-MFG]
C60  0.1uF_25V_0402  [FP-0402-L_1_0_1-W_0_5_0_1-IPC_C]
C61  10uF_10V_0402  [FP-CL05A106MP5NUNC-MFG]
C62  0.1uF_25V_0402  [FP-0402-L_1_0_1-W_0_5_0_1-IPC_C]
C63  10uF_10V_0402  [FP-CL05A106MP5NUNC-MFG]
C64  0.1uF_25V_0402  [FP-0402-L_1_0_1-W_0_5_0_1-IPC_C]
C68  0.1uF_25V_0402  [FP-0402-L_1_0_1-W_0_5_0_1-IPC_C]
C69  0.1uF_25V_0402  [FP-0402-L_1_0_1-W_0_5_0_1-IPC_C]
C71  10uF_10V_0402  [FP-CL05A106MP5NUNC-MFG]
C72  0.1uF_25V_0402  [FP-0402-L_1_0_1-W_0_5_0_1-IPC_C]
C73  0.1uF_25V_0402  [FP-0402-L_1_0_1-W_0_5_0_1-IPC_C]
C74  10uF_10V_0402  [FP-CL05A106MP5NUNC-MFG]
C75  0.1uF_25V_0402  [FP-0402-L_1_0_1-W_0_5_0_1-IPC_C]
C76  10uF_10V_0402  [FP-CL05A106MP5NUNC-MFG]
C77  0.1uF_25V_0402  [FP-0402-L_1_0_1-W_0_5_0_1-IPC_C]
C78  0.1uF_25V_0402  [FP-0402-L_1_0_1-W_0_5_0_1-IPC_C]
C79  0.1uF_25V_0402  [FP-0402-L_1_0_1-W_0_5_0_1-IPC_C]
C80  10uF_10V_0402  [FP-CL05A106MP5NUNC-MFG]
C81  0.1uF_25V_0402  [FP-0402-L_1_0_1-W_0_5_0_1-IPC_C]
C82  10uF_10V_0402  [FP-CL05A106MP5NUNC-MFG]
C83  0.1uF_25V_0402  [FP-0402-L_1_0_1-W_0_5_0_1-IPC_C]
C84  10uF_10V_0402  [FP-CL05A106MP5NUNC-MFG]
C85  0.1uF_25V_0402  [FP-0402-L_1_0_1-W_0_5_0_1-IPC_C]
C86  0.1uF_25V_0402  [FP-0402-L_1_0_1-W_0_5_0_1-IPC_C]
C87  10uF_10V_0402  [FP-CL05A106MP5NUNC-MFG]
C88  0.1uF_25V_0402  [FP-0402-L_1_0_1-W_0_5_0_1-IPC_C]
C89  0.1uF_25V_0402  [FP-0402-L_1_0_1-W_0_5_0_1-IPC_C]
C90  0.1uF_25V_0402  [FP-0402-L_1_0_1-W_0_5_0_1-IPC_C]
C170  10uF_10V_0402  [FP-CL05A106MP5NUNC-MFG]
C184  0.1uF_25V_0402  [FP-0402-L_1_0_1-W_0_5_0_1-IPC_C]
C208  0.1uF_25V_0402  [FP-0402-L_1_0_1-W_0_5_0_1-IPC_C]
C215  10uF_10V_0402  [FP-CL05A106MP5NUNC-MFG]
C216  0.1uF_25V_0402  [FP-0402-L_1_0_1-W_0_5_0_1-IPC_C]
C217  0.1uF_25V_0402  [FP-0402-L_1_0_1-W_0_5_0_1-IPC_C]
C218  10uF_10V_0402  [FP-CL05A106MP5NUNC-MFG]
C219  0.1uF_25V_0402  [FP-0402-L_1_0_1-W_0_5_0_1-IPC_C]
C220  10uF_10V_0402  [FP-CL05A106MP5NUNC-MFG]
C221  0.1uF_25V_0402  [FP-0402-L_1_0_1-W_0_5_0_1-IPC_C]
C222  10uF_10V_0402  [FP-CL05A106MP5NUNC-MFG]
C223  0.1uF_25V_0402  [FP-0402-L_1_0_1-W_0_5_0_1-IPC_C]
C227  10uF_10V_0402  [FP-CL05A106MP5NUNC-MFG]
C228  0.1uF_25V_0402  [FP-0402-L_1_0_1-W_0_5_0_1-IPC_C]
C229  10uF_10V_0402  [FP-CL05A106MP5NUNC-MFG]
C230  0.1uF_25V_0402  [FP-0402-L_1_0_1-W_0_5_0_1-IPC_C]
C231  0.1uF_25V_0402  [FP-0402-L_1_0_1-W_0_5_0_1-IPC_C]
C232  10uF_10V_0402  [FP-CL05A106MP5NUNC-MFG]
C233  0.1uF_25V_0402  [FP-0402-L_1_0_1-W_0_5_0_1-IPC_C]
C235  0.1uF_25V_0402  [FP-0402-L_1_0_1-W_0_5_0_1-IPC_C]
C236  10uF_10V_0402  [FP-CL05A106MP5NUNC-MFG]
C237  0.1uF_25V_0402  [FP-0402-L_1_0_1-W_0_5_0_1-IPC_C]
C238  10uF_10V_0402  [FP-CL05A106MP5NUNC-MFG]
C239  0.1uF_25V_0402  [FP-0402-L_1_0_1-W_0_5_0_1-IPC_C]
C240  10uF_10V_0402  [FP-CL05A106MP5NUNC-MFG]
C241  0.1uF_25V_0402  [FP-0402-L_1_0_1-W_0_5_0_1-IPC_C]
C242  10uF_10V_0402  [FP-CL05A106MP5NUNC-MFG]
C243  0.1uF_25V_0402  [FP-0402-L_1_0_1-W_0_5_0_1-IPC_C]
C244  10uF_10V_0402  [FP-CL05A106MP5NUNC-MFG]
C245  0.1uF_25V_0402  [FP-0402-L_1_0_1-W_0_5_0_1-IPC_C]
C246  0.1uF_25V_0402  [FP-0402-L_1_0_1-W_0_5_0_1-IPC_C]
C247  10uF_10V_0402  [FP-CL05A106MP5NUNC-MFG]
C248  0.1uF_25V_0402  [FP-0402-L_1_0_1-W_0_5_0_1-IPC_C]
C249  0.1uF_25V_0402  [FP-0402-L_1_0_1-W_0_5_0_1-IPC_C]
C250  10uF_10V_0402  [FP-CL05A106MP5NUNC-MFG]
C251  0.1uF_25V_0402  [FP-0402-L_1_0_1-W_0_5_0_1-IPC_C]
C252  0.1uF_25V_0402  [FP-0402-L_1_0_1-W_0_5_0_1-IPC_C]
C253  10uF_10V_0402  [FP-CL05A106MP5NUNC-MFG]
C254  0.1uF_25V_0402  [FP-0402-L_1_0_1-W_0_5_0_1-IPC_C]
C255  10uF_10V_0402  [FP-CL05A106MP5NUNC-MFG]
C256  0.1uF_25V_0402  [FP-0402-L_1_0_1-W_0_5_0_1-IPC_C]
C257  10uF_10V_0402  [FP-CL05A106MP5NUNC-MFG]
C258  0.1uF_25V_0402  [FP-0402-L_1_0_1-W_0_5_0_1-IPC_C]
C259  0.1uF_50V_0402  [FP-C1005-050-0_05-IPC_C]
C260  10uF_10V_0402  [FP-CL05A106MP5NUNC-MFG]
C261  0.1uF_25V_0402  [FP-0402-L_1_0_1-W_0_5_0_1-IPC_C]
C262  10uF_10V_0402  [FP-CL05A106MP5NUNC-MFG]
C263  0.1uF_25V_0402  [FP-0402-L_1_0_1-W_0_5_0_1-IPC_C]
C264  10uF_25V_0603  [FP-CL10-IPC_C]
C265  0.1uF_50V_0402  [FP-C1005-050-0_05-IPC_C]
FB7  742792641  [FP-742792641-MFG]
L1  742792780  [SMD-0402]
L2  742792780  [SMD-0402]
L3  742792780  [SMD-0402]
L4  742792780  [SMD-0402]
L5  742792780  [SMD-0402]
L6  742792780  [SMD-0402]
L7  742792780  [SMD-0402]
L8  742792780  [SMD-0402]
L9  742792780  [SMD-0402]
L10  742792780  [SMD-0402]
L11  742792780  [SMD-0402]
L12  742792780  [SMD-0402]
L13  742792780  [SMD-0402]
L14  742792780  [SMD-0402]
L15  742792780  [SMD-0402]
L16  742792780  [SMD-0402]
L17  742792780  [SMD-0402]
L18  742792780  [SMD-0402]
R175  0_5%_0402  [RESC1005X40X25LL10T10]
R177  0_5%_0402  [RESC1005X40X25LL10T10]
R178  100_1%_0402  [RESC1005X40X25ML05T10]
R179  49.9_1%_0402  [RESC1005X40X25NL10T10]
R180  100_1%_0402  [RESC1005X40X25ML05T10]
R181  0_5%_0402  [FP-AC0402-0_37-IPC_B]
R182  4.7K_1%_0402  [RESC1005X40X25NL10T10]
R183  4.7K_1%_0402  [RESC1005X40X25NL10T10]
R184  4.7K_1%_0402  [RESC1005X40X25NL10T10]
Y1  ASEMPC-40.000MHZ-XR-T  [FP-ASEMP-CMOS-MFG]
Y2  Manufacturer Part Number: SiT5501AI-WU033JH-10.000000  [SITIME_SPL-086-CQFN-010-C07050_REV_DRAFT]  (hidden comment: SiTime_SiT5501AC-WU-33E0-10T)

### Nets
DPLL_VDD_CLKA: C247.1 C248.1 L15.2
DPLL_VDD_CLKB: C232.1 C233.1 L11.2
DPLL_VDD_DCO_Q0123: C215.1 C216.1 L7.2
DPLL_VDD_DCO_Q4567: C229.1 C230.1 L10.2
DPLL_VDD_DIA_A: C61.1 C62.1 L3.2
DPLL_VDD_DIA_B: C80.1 C81.1 L4.2
DPLL_VDD_DIG: C63.1 C64.1 C68.1 C69.1 R175.2
DPLL_VDD_GPIO: C87.1 C88.1 C89.1 C90.1 R177.2
DPLL_VDDA_BG_LC: C71.1 C72.1 C73.1 L2.2
DPLL_VDDA_FB: C242.1 C243.1 L14.2
DPLL_VDDA_PDCP_XTAL: C170.1 C184.1 L6.2
DPLL_VDDO_Q0: C227.1 C228.1 L9.2
DPLL_VDDO_Q1: C244.1 C245.1 L13.2
DPLL_VDDO_Q2: C253.1 C254.1 L16.2
DPLL_VDDO_Q3: C262.1 C263.1 L18.2
DPLL_VDDO_Q4: C59.1 C60.1 L1.2
DPLL_VDDO_Q5: C84.1 C85.1 L5.2
DPLL_VDDO_Q6: C220.1 C221.1 L8.2
DPLL_VDDO_Q7: C238.1 C239.1 L12.2
GND: C55.2 C56.2 C59.2 C60.2 C61.2 C62.2 C63.2 C64.2 C68.2 C69.2 C71.2 C72.2 C73.2 C74.2 C75.2 C76.2 C77.2 C78.2 C79.2 C80.2 C81.2 C82.2 C83.2 C84.2 C85.2 C86.2 C87.2 C88.2 C89.2 C90.2 C170.2 C184.2 C208.2 C215.2 C216.2 C217.2 C218.2 C219.2 C220.2 C221.2 C222.2 C223.2 C227.2 C228.2 C229.2 C230.2 C231.2 C232.2 C233.2 C235.2 C236.2 C237.2 C238.2 C239.2 C240.2 C241.2 C242.2 C243.2 C244.2 C245.2 C246.2 C247.2 C248.2 C250.2 C251.2 C252.2 C253.2 C254.2 C255.2 C256.2 C257.2 C258.2 C259.1 C260.2 C261.2 C262.2 C263.2 C264.2 C265.1 R180.1 Y1.3(GND) Y2.5(GND)
P1V8: C76.1 C77.1 C78.1 C86.1 C217.1 C231.1 C246.1 L3.1 L4.1 L7.1 L10.1 L14.1 R175.1
P3V3: C55.1 C56.1 C74.1 C75.1 C79.1 C82.1 C83.1 C208.1 C218.1 C219.1 C222.1 C223.1 C235.1 C236.1 C237.1 C240.1 C241.1 C250.1 C251.1 C252.1 C255.1 C256.1 C259.2 C260.1 C261.1 FB7.2 L1.1 L2.1 L5.1 L6.1 L8.1 L9.1 L11.1 L12.1 L13.1 L15.1 L16.1 L17.1 L18.1 R177.1 R178.2 R183.2 R184.2
DPLL_OSCI: C249.2 ; off-sheet DPLL_OSCI
DPLL_XO: R181.1 ; off-sheet DPLL_XO
SiT5501_PLL_SCL: Y2.3(NC) ; off-sheet SiT5501_PLL_SCL
SiT5501_PLL_SDA: Y2.2(NC) ; off-sheet SiT5501_PLL_SDA
NetC249_1: C249.1 R178.1 R179.2 R180.2
NetC257_1: C257.1 C258.1 L17.2 Y1.1(~{Tri-State}) Y1.6(VDD)
NetC264_1: C264.1 C265.2 FB7.1 R182.1 Y2.10(VDD)
NetR179_1: R179.1 Y1.4(Output)
NetR181_2: R181.2 Y2.6(CLK)
NetR182_2: R182.2 Y2.1(OE)
NetR183_1: R183.1 Y2.7(NC)
NetR184_1: R184.1 Y2.8(NC)

Not connected (* = marked no-connect by the designer): Y2 4(NC) 9(NC)

### Layout directives
net class 50SE: NetR181_2

### Notes on the sheet
- 1.8V
- Input voltage supply for CLK4/CLK5/CLK6, Using 3.3V
- Input voltage supply for CLK0/CLK1/CLK2/CLK3, Using 3.3V
- 10MHz Source for DPLL

### Library data of the parts
C55 C59 C61 C63 C71 C74 C76 C80 C82 C84 C87 C170 C215 C218 C220 C222 C227 C229 C232 C236 C238 C240 C242 C244 C247 C250 C253 C255 C257 C260 C262 = CMP-13271-000002-1: CAP CER 10UF 10V X5R 0402; Manufacturer Part Number: CL05A106MP5NUNC; Manufacturer: Samsung; Temperature Coefficient: 15%; Tolerance: 20%; Material: Ceramic; Octopart: https://octopart.com/cl05a106mp5nunc-samsung-22457395; Voltage Rating: 10V; RoHS: TRUE; Value: 10uF; Height: 0.7mm; Digikey Description: CAP CER 10UF 10V X5R 0402; Automotive: No; Package: CL05A106MP5NUNC; Device Class L1: Passive Components; Capacitance: 10uF; Temperature Range High: +85°C; ComponentLink2Description: Datasheet; Device Class L2: Capacitors; Temperature Characteristic: X5R; Temperature: -55°C to +85°C; ComponentLink2URL: http://www.samsungsem.com/kr/support/product-search/mlcc/__icsFiles/afieldfile/2019/05/10/19-CL05A106MP5NUNC.pdf; Device Class L3: Ceramic Capacitors; Category: Cap; Temperature Range Low: -55°C; Ipc Land Pattern Name: CAPC10050X50; Lead Free: Yes
C56 C60 C62 C64 C68 C69 C72 C73 C75 C77-C79 C81 C83 C85 C86 C88-C90 C184 C208 C216 C217 C219 C221 C223 C228 C230 C231 C233 C235 C237 C239 C241 C243 C245 C246 C248 C249 C251 C252 C254 C256 C258 C261 C263 = CMP-2008-02519-2: as C7 on sheet 05-Front Panel SFP+; Package Quantity: 1; Capacitance: 100nF; Min Operating Temperature: -55°C; Voltage: 25V; Voltage Rating: 25V; Construction: Flat; Max Operating Temperature: 125°C; Radiation Hardening: No; Depth: 0.5mm; Thickness: 0.022inch; Voltage Rating (DC): 25V; Number of Pins: 2; Lead Free: Lead Free; Series: -; REACH SVHC: No SVHC; Length: 1mm; Dielectric: X7R; RoHS Compliant: Yes; Mount: Surface Mount; Packaging: Tape and Reel; Case/Package: 0402; Case Code (Imperial): 0402; Termination: SMD/SMT; Width: 0.02inch; Case Code (Metric): 1005; Tolerance: 10%
C259 C265 = CMP-2000-05393-2: Multilayer Ceramic Capacitors 100nF ±10% 50V X7R SMD 0402; Voltage: 50V; Dielectric Material: Ceramic; Min Operating Temperature: -55°C; Depth: 0.5mm; Radiation Hardening: No; RoHS Compliant: Yes; Voltage Rating (DC): 50V; Lead Free: Lead Free; Resistor Type: Ceramic; Height: 0.5mm; Dielectric: X7R; Thickness: 0.022inch; Case/Package: 0402; Case Code (Metric): 1005; Termination: SMD/SMT; Capacitance: 100nF; Packaging: Tape and Reel; Max Operating Temperature: 125°C; Mount: Surface Mount; Package Quantity: 1; Width: 0.02inch; Weight: 2.3E-05oz; Voltage Rating: 50V; Tolerance: 10%; Construction: Flat; Case Code (Imperial): 0402; Length: 1mm; REACH SVHC: No SVHC; Series: C
C264 = CMP-13271-004224-1: Cap Ceramic 10uF 25V X5R ±20% Pad SMD 0603 +85°C T/R; Width: 0.031inch; Voltage Rating: 25V; Length: 0.063inch; Case Code (Metric): 1608; Dielectric: X5R; Termination: Wraparound; Capacitance: 10uF; Lead Free: Lead Free; Mount: Surface Mount; Package Quantity: 1; Case Code (Imperial): 0603; Thickness: 0.035inch; Packaging: Tape and Reel; Contact Plating: Tin; Min Operating Temperature: -55°C; Tolerance: 20%; Max Operating Temperature: 85°C; Case/Package: 0603
FB7 = CMP-0220-00171-2: FERRITE BEAD 300 OHM 0603 1LN; Inductance: 18nH; Max DC Current: 2A; Number of Lines: 1; Test Frequency: 100MHz; Impedance: 300R; DC Resistance (DCR): 150mR; Tolerance: 25%; Case Code (Metric): 1608; Core Material: Ferrite; Length: 1.6mm; Lead Free: Lead Free; Series: WE-CBF; Min Operating Temperature: -55°C; RoHS Compliant: Yes; Case/Package: SMD/SMT; Material: Ferrite; Max Operating Temperature: 125°C; Termination: SMD/SMT; Packaging: Tape and Reel; Weight: 0.000141oz; Case Code (Imperial): 0603; Width: 0.8mm; Mount: Surface Mount; Max Current Rating: 2A; Package Quantity: 1; Depth: 0.8mm; Current Rating: 2A; Height: 0.8mm
L1-L18 = CMP-0220-00137-1: SMD EMI Suppression Ferrite Bead WE-CBF, Z = 220 Ohm; Impedance: 220 Ohm; PackageVersion: 2009; DatasheetVersion: ver 4, Jul-2009; PackageDescription: Chip Inductor, 2-Leads, Body 1.0 x 0.5 mm; ComponentLink1URL: http://www.we-online.com; ComponentLink1Description: Manufacturer Link; ComponentLink2URL: http://www.we-online.de/katalog/media/pdf/742792780.pdf; PackageReference: SMD-0402; ComponentLink2Description: Datasheet
R175 R177 = CMP-2002-04569-1: Manufacturer: KOA Speer; Part Number: RK73Z1ETTP
R178 R180 = CMP-2002-06458-1: Part Number: ERJ-U02F1000X; Manufacturer: Panasonic
R179 = CMP-2002-04448-1: Part Number: RK73H1ETTP49R9F; Manufacturer: KOA Speer
R181 = CMP-2002-01772-2: RESISTOR 0402 JUMPER ZERO OHM; Voltage Rating: 50V; Temperature Coefficient: 200ppm/°C; Tolerance: 1%; Power Rating: 62.5mW; Resistance: 0R; Min Operating Temperature: -55°C; Termination: SMD/SMT; Case/Package: 0402; Case Code (Imperial): 0402; Packaging: Tape and Reel; Case Code (Metric): 1005; Max Operating Temperature: 155°C; Series: AC
R182-R184 = CMP-2002-05217-1: as R2 on sheet 05-Front Panel SFP+
Y1 = CMP-27762-012912-1: MEMS Oscillator 40MHz ±25ppm CMOS 2.25V~3.6V 6-SMD 3.2mm x 2.5mm; Max Supply Current: 35mA; Max Duty Cycle: 55%; Operating Supply Voltage: 3.3V; Max Supply Voltage: 3.6V; Load Capacitance: 15pF; Min Supply Voltage: 2.25V; Termination: SMD/SMT; Frequency: 40MHz; Length: 0.126inch; Case/Package: SMD/SMT; Max Operating Temperature: 105°C; RoHS Compliant: Yes; Mount: Surface Mount; Packaging: Tape and Reel; Number of Pins: 6; Width: 0.098inch; Min Operating Temperature: -40°C; Frequency Stability: 25ppm; Height: 0.035inch; Package Quantity: 1000
Y2 = CMP-OSC-00029-2: OSC, MEMS, STRATUM 3E, 10.000MHZ, 10PPB STAB, LVCMOS, 3.3V, O/P EN, 7.0X5.0X2.2MM, CQFN-10; Manufacturer: SiTime; Frequency: 10 MHz; Voltage - Supply: 3.3 V; Type: OCXO; Category: Oscillators; Max Operating Temperature: 70°C; Min Operating Temperature: -20°C; Height: 2.20mm (max); Case/Package: 10 Lead QFN; Output: LVCMOS; Mounting Type: Surface Mount; Frequency Stability: ±10 ppb; RoHS: Yes

## Sheet 09-DPLL-3.SchDoc
size B; SheetNumber: 9; SheetTotal: 20
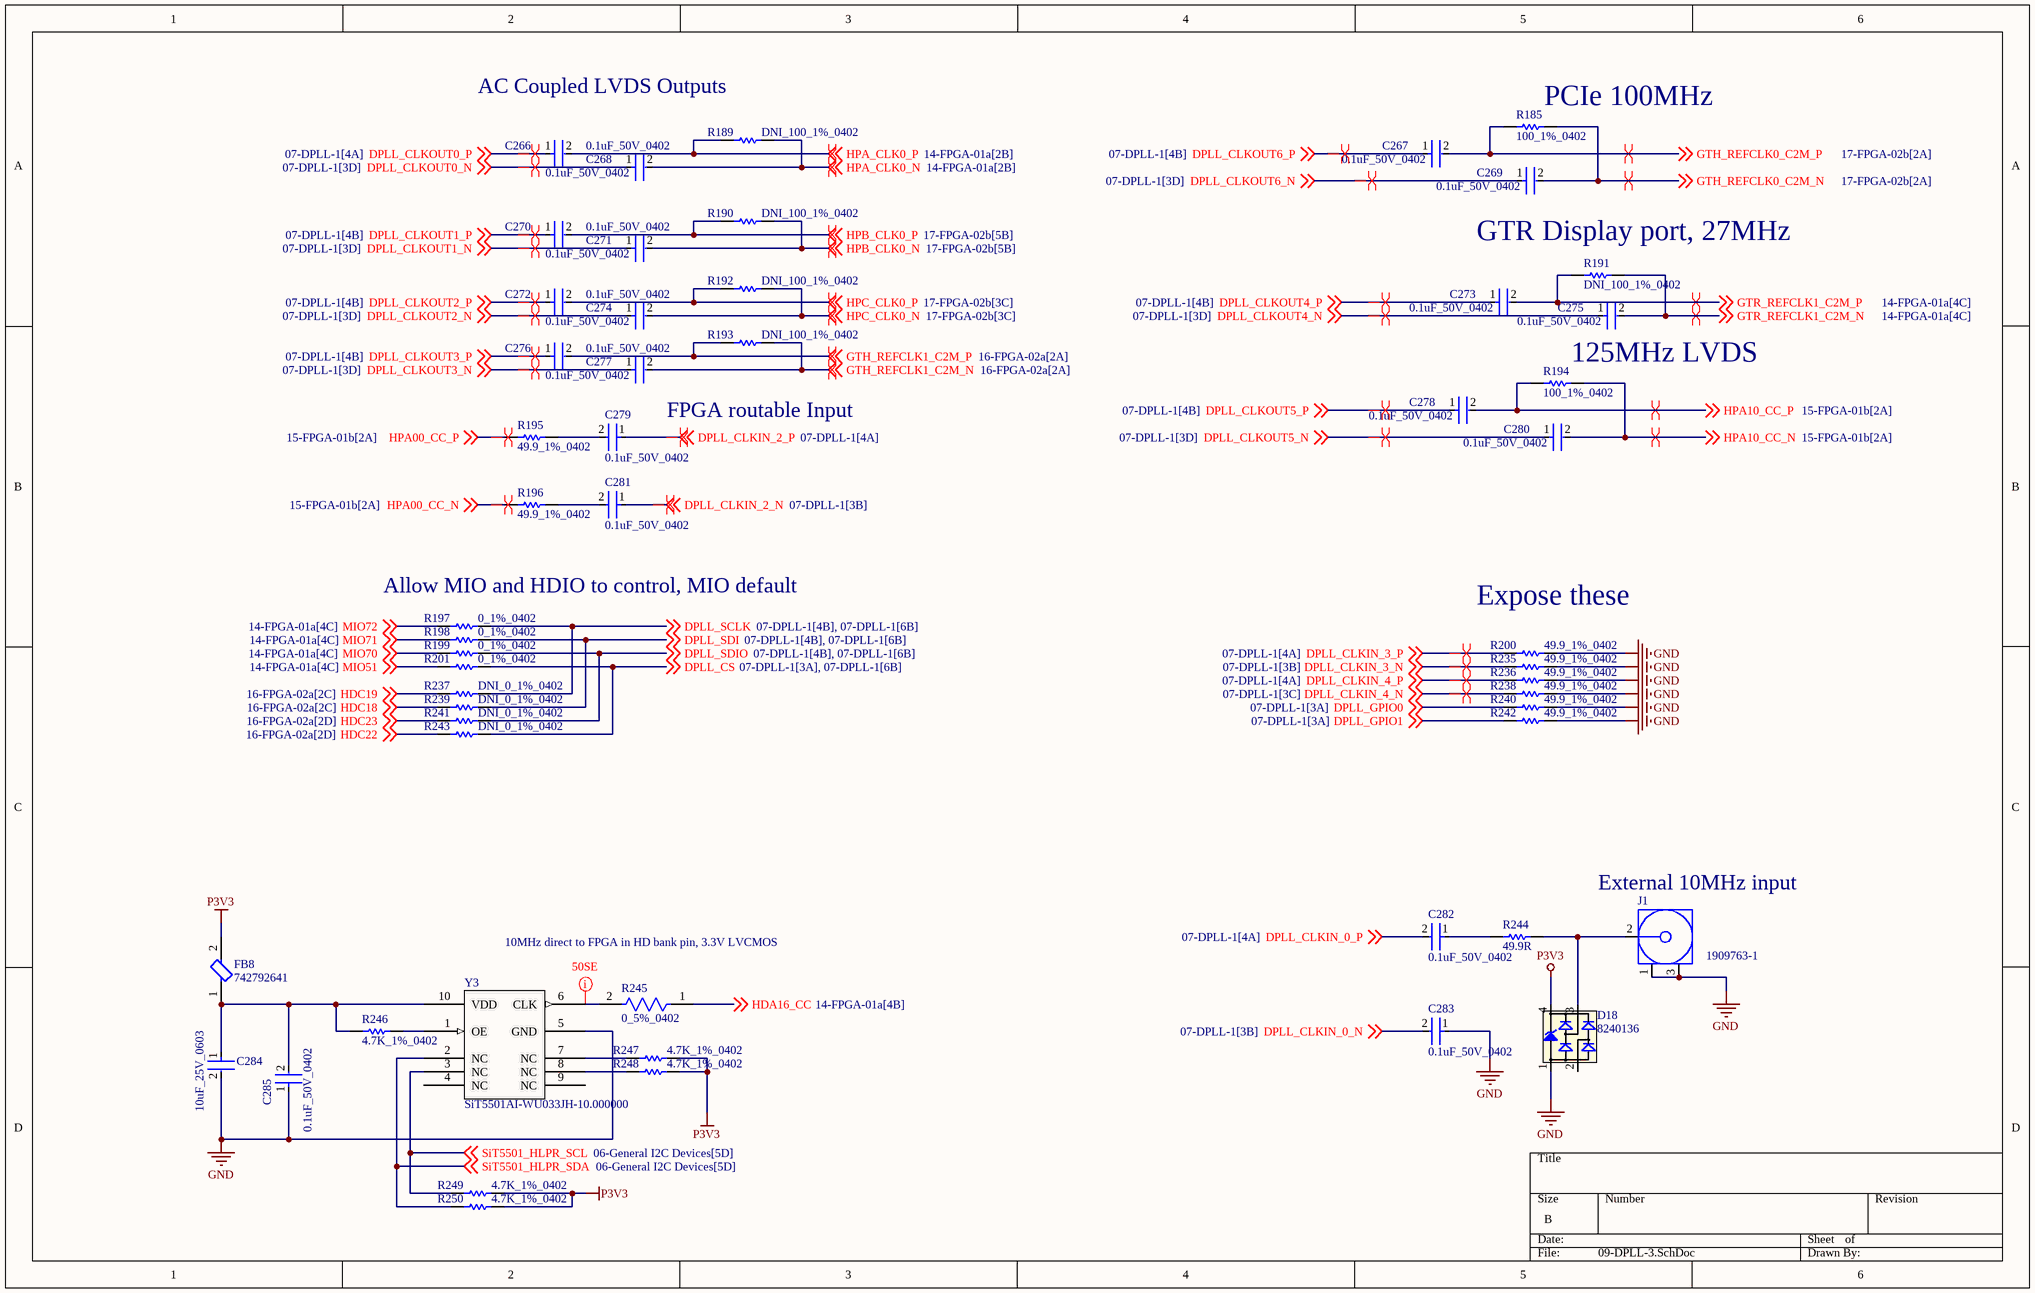
[diagram p3: 09-DPLL-3.SchDoc]

### Parts
C266  0.1uF_50V_0402  [FP-C1005-050-0_05-IPC_C]
C267  0.1uF_50V_0402  [FP-C1005-050-0_05-IPC_C]
C268  0.1uF_50V_0402  [FP-C1005-050-0_05-IPC_C]
C269  0.1uF_50V_0402  [FP-C1005-050-0_05-IPC_C]
C270  0.1uF_50V_0402  [FP-C1005-050-0_05-IPC_C]
C271  0.1uF_50V_0402  [FP-C1005-050-0_05-IPC_C]
C272  0.1uF_50V_0402  [FP-C1005-050-0_05-IPC_C]
C273  0.1uF_50V_0402  [FP-C1005-050-0_05-IPC_C]
C274  0.1uF_50V_0402  [FP-C1005-050-0_05-IPC_C]
C275  0.1uF_50V_0402  [FP-C1005-050-0_05-IPC_C]
C276  0.1uF_50V_0402  [FP-C1005-050-0_05-IPC_C]
C277  0.1uF_50V_0402  [FP-C1005-050-0_05-IPC_C]
C278  0.1uF_50V_0402  [FP-C1005-050-0_05-IPC_C]
C279  0.1uF_50V_0402  [FP-C1005-050-0_05-IPC_C]
C280  0.1uF_50V_0402  [FP-C1005-050-0_05-IPC_C]
C281  0.1uF_50V_0402  [FP-C1005-050-0_05-IPC_C]
C282  0.1uF_50V_0402  [FP-C1005-050-0_05-IPC_C]
C283  0.1uF_50V_0402  [FP-C1005-050-0_05-IPC_C]
C284  10uF_25V_0603  [FP-CL10-IPC_C]
C285  0.1uF_50V_0402  [FP-C1005-050-0_05-IPC_C]
D18  8240136  [SOT143-4L]
FB8  742792641  [FP-742792641-MFG]
J1  1909763-1  [TECO-1909763-1_V]
R185  100_1%_0402  [RESC1005X40X25ML05T10]
R189  DNI_100_1%_0402  [RESC1005X40X25LL05T05]  (no BOM)
R190  DNI_100_1%_0402  [RESC1005X40X25LL05T05]  (no BOM)
R191  DNI_100_1%_0402  [RESC1005X40X25ML05T10]  (no BOM)
R192  DNI_100_1%_0402  [RESC1005X40X25LL05T05]  (no BOM)
R193  DNI_100_1%_0402  [RESC1005X40X25LL05T05]
R194  100_1%_0402  [RESC1005X40X25ML05T10]
R195  49.9_1%_0402  [RESC1005X40X25NL10T10]
R196  49.9_1%_0402  [RESC1005X40X25NL10T10]
R197  0_1%_0402  [RESC1005X40X25LL05T05]
R198  0_1%_0402  [RESC1005X40X25LL05T05]
R199  0_1%_0402  [RESC1005X40X25LL05T05]
R200  49.9_1%_0402  [RESC1005X40X25NL10T10]
R201  0_1%_0402  [RESC1005X40X25LL05T05]
R235  49.9_1%_0402  [RESC1005X40X25NL10T10]
R236  49.9_1%_0402  [RESC1005X40X25NL10T10]
R237  DNI_0_1%_0402  [RESC1005X40X25LL05T05]  (no BOM)
R238  49.9_1%_0402  [RESC1005X40X25NL10T10]
R239  DNI_0_1%_0402  [RESC1005X40X25LL05T05]  (no BOM)
R240  49.9_1%_0402  [RESC1005X40X25NL10T10]
R241  DNI_0_1%_0402  [RESC1005X40X25LL05T05]  (no BOM)
R242  49.9_1%_0402  [RESC1005X40X25NL10T10]
R243  DNI_0_1%_0402  [RESC1005X40X25LL05T05]  (no BOM)
R244  49.9R  [RESC1608X55X25NL10T15]
R245  0_5%_0402  [FP-AC0402-0_37-IPC_B]
R246  4.7K_1%_0402  [RESC1005X40X25NL10T10]
R247  4.7K_1%_0402  [RESC1005X40X25NL10T10]
R248  4.7K_1%_0402  [RESC1005X40X25NL10T10]
R249  4.7K_1%_0402  [RESC1005X40X25NL10T10]
R250  4.7K_1%_0402  [RESC1005X40X25NL10T10]
Y3  Manufacturer Part Number: SiT5501AI-WU033JH-10.000000  [SITIME_SPL-086-CQFN-010-C07050_REV_DRAFT]  (hidden comment: SiTime_SiT5501AC-WU-33E0-10T)

### Nets
GND: C283.1 C284.2 C285.1 D18.1(GND) J1.1 J1.3 R200.2 R235.2 R236.2 R238.2 R240.2 R242.2 Y3.5(GND)
P3V3: D18.4(VDD) FB8.2 R247.2 R248.2 R249.2 R250.2
DPLL_CLKIN_0_N: C283.2 ; off-sheet DPLL_CLKIN_0_N
DPLL_CLKIN_0_P: C282.2 ; off-sheet DPLL_CLKIN_0_P
DPLL_CLKIN_2_N: C281.1 ; off-sheet DPLL_CLKIN_2_N
DPLL_CLKIN_2_P: C279.1 ; off-sheet DPLL_CLKIN_2_P
DPLL_CLKIN_3_N: R235.1 ; off-sheet DPLL_CLKIN_3_N
DPLL_CLKIN_3_P: R200.1 ; off-sheet DPLL_CLKIN_3_P
DPLL_CLKIN_4_N: R238.1 ; off-sheet DPLL_CLKIN_4_N
DPLL_CLKIN_4_P: R236.1 ; off-sheet DPLL_CLKIN_4_P
DPLL_CLKOUT0_N: C268.1 ; off-sheet DPLL_CLKOUT0_N
DPLL_CLKOUT0_P: C266.1 ; off-sheet DPLL_CLKOUT0_P
DPLL_CLKOUT1_N: C271.1 ; off-sheet DPLL_CLKOUT1_N
DPLL_CLKOUT1_P: C270.1 ; off-sheet DPLL_CLKOUT1_P
DPLL_CLKOUT2_N: C274.1 ; off-sheet DPLL_CLKOUT2_N
DPLL_CLKOUT2_P: C272.1 ; off-sheet DPLL_CLKOUT2_P
DPLL_CLKOUT3_N: C277.1 ; off-sheet DPLL_CLKOUT3_N
DPLL_CLKOUT3_P: C276.1 ; off-sheet DPLL_CLKOUT3_P
DPLL_CLKOUT4_N: C275.1 ; off-sheet DPLL_CLKOUT4_N
DPLL_CLKOUT4_P: C273.1 ; off-sheet DPLL_CLKOUT4_P
DPLL_CLKOUT5_N: C280.1 ; off-sheet DPLL_CLKOUT5_N
DPLL_CLKOUT5_P: C278.1 ; off-sheet DPLL_CLKOUT5_P
DPLL_CLKOUT6_N: C269.1 ; off-sheet DPLL_CLKOUT6_N
DPLL_CLKOUT6_P: C267.1 ; off-sheet DPLL_CLKOUT6_P
DPLL_CS: R201.2 R243.2 ; off-sheet DPLL_CS
DPLL_GPIO0: R240.1 ; off-sheet DPLL_GPIO0
DPLL_GPIO1: R242.1 ; off-sheet DPLL_GPIO1
DPLL_SCLK: R197.2 R237.2 ; off-sheet DPLL_SCLK
DPLL_SDI: R198.2 R239.2 ; off-sheet DPLL_SDI
DPLL_SDIO: R199.2 R241.2 ; off-sheet DPLL_SDIO
GTH_REFCLK0_C2M_N: C269.2 R185.2 ; off-sheet GTH_REFCLK0_C2M_N
GTH_REFCLK0_C2M_P: C267.2 R185.1 ; off-sheet GTH_REFCLK0_C2M_P
GTH_REFCLK1_C2M_N: C277.2 R193.2 ; off-sheet GTH_REFCLK1_C2M_N
GTH_REFCLK1_C2M_P: C276.2 R193.1 ; off-sheet GTH_REFCLK1_C2M_P
GTR_REFCLK1_C2M_N: C275.2 R191.2 ; off-sheet GTR_REFCLK1_C2M_N
GTR_REFCLK1_C2M_P: C273.2 R191.1 ; off-sheet GTR_REFCLK1_C2M_P
HDA16_CC: R245.1 ; off-sheet HDA16_CC
HDC18: R239.1 ; off-sheet HDC18
HDC19: R237.1 ; off-sheet HDC19
HDC22: R243.1 ; off-sheet HDC22
HDC23: R241.1 ; off-sheet HDC23
HPA00_CC_N: R196.1 ; off-sheet HPA00_CC_N
HPA00_CC_P: R195.1 ; off-sheet HPA00_CC_P
HPA10_CC_N: C280.2 R194.2 ; off-sheet HPA10_CC_N
HPA10_CC_P: C278.2 R194.1 ; off-sheet HPA10_CC_P
HPA_CLK0_N: C268.2 R189.2 ; off-sheet HPA_CLK0_N
HPA_CLK0_P: C266.2 R189.1 ; off-sheet HPA_CLK0_P
HPB_CLK0_N: C271.2 R190.2 ; off-sheet HPB_CLK0_N
HPB_CLK0_P: C270.2 R190.1 ; off-sheet HPB_CLK0_P
HPC_CLK0_N: C274.2 R192.2 ; off-sheet HPC_CLK0_N
HPC_CLK0_P: C272.2 R192.1 ; off-sheet HPC_CLK0_P
MIO51: R201.1 ; off-sheet MIO51
MIO70: R199.1 ; off-sheet MIO70
MIO71: R198.1 ; off-sheet MIO71
MIO72: R197.1 ; off-sheet MIO72
SiT5501_HLPR_SCL: R249.1 Y3.3(NC) ; off-sheet SiT5501_HLPR_SCL
SiT5501_HLPR_SDA: R250.1 Y3.2(NC) ; off-sheet SiT5501_HLPR_SDA
NetC279_2: C279.2 R195.2
NetC281_2: C281.2 R196.2
NetC282_1: C282.1 R244.1
NetC284_1: C284.1 C285.2 FB8.1 R246.2 Y3.10(VDD)
NetD18_3: D18.3(I/O2) J1.2 R244.2
NetR245_2: R245.2 Y3.6(CLK)
NetR246_1: R246.1 Y3.1(OE)
NetR247_1: R247.1 Y3.7(NC)
NetR248_1: R248.1 Y3.8(NC)

Not connected (* = marked no-connect by the designer): D18 2(I/O1); Y3 4(NC) 9(NC)

### Layout directives
differential pair: DPLL_CLKIN_2_N, DPLL_CLKIN_2_P, DPLL_CLKIN_3_N, DPLL_CLKIN_3_P, DPLL_CLKIN_4_N, DPLL_CLKIN_4_P, DPLL_CLKOUT0_N, DPLL_CLKOUT0_P, DPLL_CLKOUT1_N, DPLL_CLKOUT1_P, DPLL_CLKOUT2_N, DPLL_CLKOUT2_P, DPLL_CLKOUT3_N, DPLL_CLKOUT3_P, DPLL_CLKOUT4_N, DPLL_CLKOUT4_P, DPLL_CLKOUT5_N, DPLL_CLKOUT5_P, DPLL_CLKOUT6_N, DPLL_CLKOUT6_P, GTH_REFCLK0_C2M_N, GTH_REFCLK0_C2M_P, GTH_REFCLK1_C2M_N, GTH_REFCLK1_C2M_P, GTR_REFCLK1_C2M_N, GTR_REFCLK1_C2M_P, HPA00_CC_N, HPA00_CC_P, HPA10_CC_N, HPA10_CC_P, HPA_CLK0_N, HPA_CLK0_P, HPB_CLK0_N, HPB_CLK0_P, HPC_CLK0_N, HPC_CLK0_P
net class 50SE: NetR245_2

### Notes on the sheet
- AC Coupled LVDS Outputs
- (near R185) PCIe 100MHz
- GTR Display port, 27MHz
- 125MHz LVDS
- FPGA routable Input
- Allow MIO and HDIO to control, MIO default
- Expose these
- (near J1) External 10MHz input
- 10MHz direct to FPGA in HD bank pin, 3.3V LVCMOS

### Library data of the parts
C266-C283 C285 = CMP-2000-05393-2: as C259 on sheet 08-DPLL-2; Voltage: 50V; Dielectric Material: Ceramic; Min Operating Temperature: -55°C; Depth: 0.5mm; Radiation Hardening: No; RoHS Compliant: Yes; Voltage Rating (DC): 50V; Lead Free: Lead Free; Resistor Type: Ceramic; Height: 0.5mm; Dielectric: X7R; Thickness: 0.022inch; Case/Package: 0402; Case Code (Metric): 1005; Termination: SMD/SMT; Capacitance: 100nF; Packaging: Tape and Reel; Max Operating Temperature: 125°C; Mount: Surface Mount; Package Quantity: 1; Width: 0.02inch; Weight: 2.3E-05oz; Voltage Rating: 50V; Tolerance: 10%; Construction: Flat; Case Code (Imperial): 0402; Length: 1mm; REACH SVHC: No SVHC; Series: C
C284 = CMP-13271-004224-1: as C264 on sheet 08-DPLL-2; Width: 0.031inch; Voltage Rating: 25V; Length: 0.063inch; Case Code (Metric): 1608; Dielectric: X5R; Termination: Wraparound; Capacitance: 10uF; Lead Free: Lead Free; Mount: Surface Mount; Package Quantity: 1; Case Code (Imperial): 0603; Thickness: 0.035inch; Packaging: Tape and Reel; Contact Plating: Tin; Min Operating Temperature: -55°C; Tolerance: 20%; Max Operating Temperature: 85°C; Case/Package: 0603
D18 = CMP-1486-00002-1: TVS Diode WE-TVS-HS, VRWM=3.3V; Manufacturer: Wuerth Elektronik; Reverse Stand Off Voltage: 3.3V; PartNumber: 8240136; ComponentLink1Description: Manufacturer URL; PackageReference: SOT143-4L; ComponentLink1URL: http://www.we-online.com; ComponentLink2Description: Datasheet; ComponentLink2URL: http://katalog.we-online.de/kataloge/eisos/media/pdf/8240136.pdf
FB8 = CMP-0220-00171-2: as FB7 on sheet 08-DPLL-2; Case Code (Metric): 1608; Core Material: Ferrite; Length: 1.6mm; Lead Free: Lead Free; Series: WE-CBF; Min Operating Temperature: -55°C; RoHS Compliant: Yes; Case/Package: SMD/SMT; Material: Ferrite; Max Operating Temperature: 125°C; Termination: SMD/SMT; Packaging: Tape and Reel; Weight: 0.000141oz; Case Code (Imperial): 0603; Width: 0.8mm; Mount: Surface Mount; Max Current Rating: 2A; Package Quantity: 1; Depth: 0.8mm; Current Rating: 2A; Height: 0.8mm
J1 = CMP-2000-07505-1: Ultra Miniature Coaxial Connector Jack, 60 V, 50 Ohm, -40 to 90 degC, RoHS, Tape and Reel; Manufacturer: TE Connectivity; Gender: Female; PCB Mounting Orientation: Vertical; Body Material: LiquidCrystalPolymer; Case\/Package: SMD/SMT; Impedance: 50Ohm; Max Frequency: 6GHz; Body Plating: Gold; Dielectric Material: Polymer; Orientation: Straight; Mount: SurfaceMount; Length: 3mm; Packaging: TapeandReel; Connector Type: Jack; Lead Free: LeadFree; Package Quantity: 1; Termination: SMD/SMT; Contact Material: CopperAlloy; Fastening Type: Pull; RoHSCompliant: true; Max Operating Temperature: 90degC; Datasheet URL: http://www.te.com/commerce/DocumentDelivery/DDEController?Action=srchrtrv&DocNm=1909763&DocType=Customer+Drawing&DocLang=English; Contact Plating: Gold; Mounting Technology: SurfaceMount; Package Reference: TECO-1909763-1; Insulation Material: Thermoplastic; Min Operating Temperature: -40degC; Manufacturer URL: http://www.te.com/; ELV: Compliant; Datasheet Version: Rev. B2, 11/2015; Radiation Hardening: No; Package Description: 3-Pin Surface Mount Device, Body 2.6 x 2.6 mm; Housing Colour: Beige
R185 R191 R194 = CMP-2002-06458-1: as R178 on sheet 08-DPLL-2
R189 R190 R192 R193 = CMP-2002-00605-3: Chip Resistor, 100 Ohm, +/- 1%, 100 mW, -55 to 155 degC, 0402 (1005 Metric), RoHS, Tape and Reel; Manufacturer: Basic Passives; PartNumber: ERJ-2RKF1000X; Power Rating: 100 mW; Resistance: 100 Ohm; Voltage Rating: 50 V; Case\/Package: 0402; Width: 0.5 mm; Pins: 2; ComponentLink2Description: Datasheet; PackageReference: 0402; Height: 0.35 mm; Tolerance: 1%; DatasheetVersion: 04/2015; Case Code (Imperial): 0402; Min Operating Temperature: -55 degC; Radiation Hardening: No; Length: 1 mm; Package Quantity: 10000; PackageDescription: 2-Pin Surface Mount Device, Body 1 x 0.5 mm; Mounting Technology: Surface Mount; Case Code (Metric): 1005; Packaging: Tape and Reel; ComponentLink1URL: http://www.panasonic.com/; RoHSCompliant: true; Max Operating Temperature: 155 degC; REACH SVHC: Yes; ComponentLink1Description: Manufacturer URL; ComponentLink2URL: http://industrial.panasonic.com/cdbs/www-data/pdf/RDA0000/AOA0000C86.pdf; Mount: Surface Mount
R195 R196 R200 R235 R236 R238 R240 R242 = CMP-2002-04448-1: as R179 on sheet 08-DPLL-2
R197-R199 R201 R237 R239 R241 R243 = CMP-2000-07451-1: as R212 on sheet 06-General I2C Devices; Number of Terminations: 2; Mount: SurfaceMount; Height: 0.35mm; Packaging: TapeandReel; Contact Plating: Tin; Manufacturer URL: http://www.panasonic.com/; Composition: ThickFilm; Max Operating Temperature: 155degC; REACH SVHC: NoSVHC; Case/Package: 0402; Package Reference: 402; Depth: 0.5mm; Package Description: 2-Pin Surface Mount Device, Body 1 x 0.5 mm; Datasheet URL: https://industrial.panasonic.com/cdbs/www-data/pdf/RDA0000/AOA0000C301.pdf; RoHSCompliant: True; Case Code (Imperial): 0402; Military Standard: Not; Min Operating Temperature: -55degC; Power Rating: 100mW; Datasheet Version: 03/2015; Length: 1mm; Case Code (Metric): 1005; Termination: SMD/SMT; Mounting Technology: SurfaceMount; Voltage Rating: 50V; Width: 0.02inch; Package Quantity: 1; Lead Free: LeadFree; Radiation Hardening: No
R244 = CMP-1659-00036-1: General Purpose Chip Resistor, 49.9 Ohm, +/- 1%, -55 to 155 degC, 0603 (1608 Metric), RoHS, Tape and Reel; Max Supply Voltage: 3.63 V; Case\Package: LQFP; Interface: SPI; Min Supply Voltage: 2.97 V; PackageReference: 0603; Packaging: Tray; ComponentLink2Description: Datasheet; ComponentLink1Description: Manufacturer URL; ComponentLink2URL: https://datasheet.ciiva.com/11808/0900766b80f96399-11808223.pdf; RoHSCompliant: true; Max Operating Temperature: 85 degC; ComponentLink1URL: http://www.yageo.com/; PackageDescription: 2-Pin Surface Mount Device, Body 1.6 x 0.8 mm; DatasheetVersion: Rev. 4, 04/2009; Min Operating Temperature: -40 degC; Package Quantity: 250; Pins: 48
R245 = CMP-2002-01772-2: as R181 on sheet 08-DPLL-2; Min Operating Temperature: -55°C; Termination: SMD/SMT; Case/Package: 0402; Case Code (Imperial): 0402; Packaging: Tape and Reel; Case Code (Metric): 1005; Max Operating Temperature: 155°C; Series: AC
R246-R250 = CMP-2002-05217-1: as R2 on sheet 05-Front Panel SFP+
Y3 = CMP-OSC-00029-2: as Y2 on sheet 08-DPLL-2; Voltage - Supply: 3.3 V; Type: OCXO; Category: Oscillators; Max Operating Temperature: 70°C; Min Operating Temperature: -20°C; Height: 2.20mm (max); Case/Package: 10 Lead QFN; Output: LVCMOS; Mounting Type: Surface Mount; Frequency Stability: ±10 ppb; RoHS: Yes